# EAGLE design hedwig (EAGLE 9.6.2)

## Sheet 1 of 6
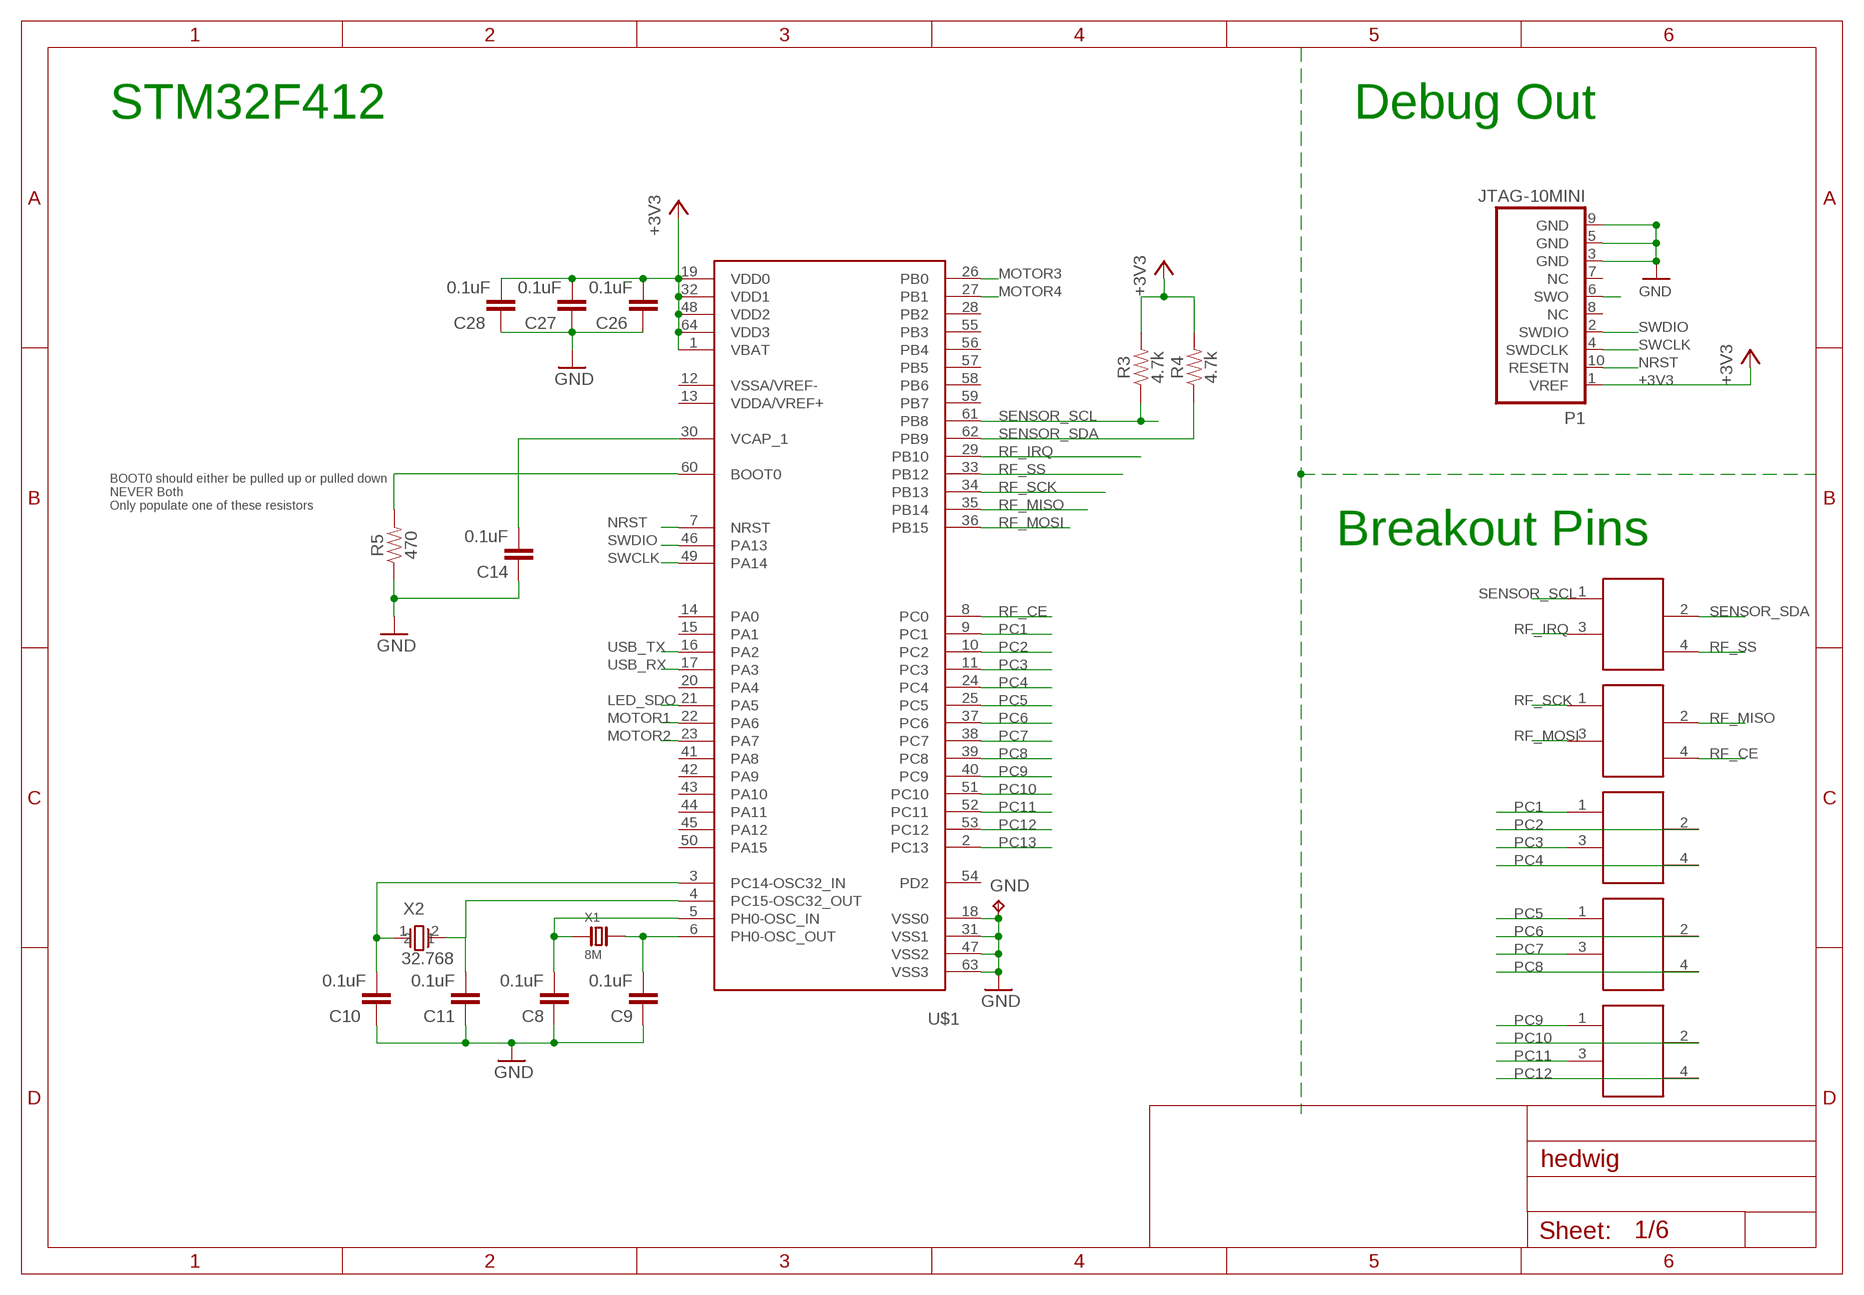
[diagram p0: schematic, sheet 1]

### Parts
C8  0.1uF  0.1UF-0603-25V-(+80/-20%)  [0603]
C9  0.1uF  0.1UF-0603-25V-(+80/-20%)  [0603]
C10  0.1uF  0.1UF-0603-25V-(+80/-20%)  [0603]
C11  0.1uF  0.1UF-0603-25V-(+80/-20%)  [0603]
C14  0.1uF  0.1UF-0603-25V-(+80/-20%)  [0603]
C26  0.1uF  0.1UF-0603-25V-(+80/-20%)  [0603]
C27  0.1uF  0.1UF-0603-25V-(+80/-20%)  [0603]
C28  0.1uF  0.1UF-0603-25V-(+80/-20%)  [0603]
GND  TPB2,54  [B2,54]
P1  JTAG-10MINI  [JTAG-10MINI]
P2  SENSOR_SCL  STAG_CONN  [STAGGERED-CONNECTOR]
P3  RF_SCK  STAG_CONN  [STAGGERED-CONNECTOR]
P4  PC1  STAG_CONN  [STAGGERED-CONNECTOR]
P5  PC5  STAG_CONN  [STAGGERED-CONNECTOR]
P6  PC9  STAG_CONN  [STAGGERED-CONNECTOR]
R3  4.7k  1.5KOHM-0603-1/10W-1%  [0603]
R4  4.7k  1.5KOHM-0603-1/10W-1%  [0603]
R5  470  1.5KOHM-0603-1/10W-1%  [0603]
U$1  STM32F412RE-S  [QFP50P1200X1200X160-64N]
X1  8M  CRYSTAL-NX3225GD  [NDK-NX3225GD]
X2  32.768  NX32  [NDK_NX3215SA-32.768K-STD-MUA-8_0]

### Nets
+3V3: C26.2 C27.2 C28.2 P1.1(VREF) R3.2 R4.2 U$1.1(VBAT) U$1.19(VDD0) U$1.32(VDD1) U$1.48(VDD2) U$1.64(VDD3) ; also sheet 2,3,4,5,6
GND: C8.1 C9.1 C10.1 C11.1 C14.1 C26.1 C27.1 C28.1 GND.TP P1.3(GND) P1.5(GND) P1.9(GND) R5.1 U$1.18(VSS0) U$1.31(VSS1) U$1.47(VSS2) U$1.63(VSS3) ; also sheet 2,3,4,5,6
LED_SDO: U$1.21(PA5) ; also sheet 5
MOTOR1: U$1.22(PA6) ; also sheet 6
MOTOR2: U$1.23(PA7) ; also sheet 6
MOTOR3: U$1.26(PB0) ; also sheet 6
MOTOR4: U$1.27(PB1) ; also sheet 6
N$8: C8.2 U$1.5(PH0-OSC_IN) X1.1
N$10: C9.2 U$1.6(PH0-OSC_OUT) X1.2
N$13: C10.2 U$1.3(PC14-OSC32_IN) X2.1
N$14: C11.2 U$1.4(PC15-OSC32_OUT) X2.2
N$16: R5.2 U$1.60(BOOT0)
N$17: C14.2 U$1.30(VCAP_1)
N$18: P1.6(SWO)
NRST: P1.10(RESETN) U$1.7(NRST) ; also sheet 5
PC1: P4.1 U$1.9(PC1)
PC2: P4.2 U$1.10(PC2)
PC3: P4.3 U$1.11(PC3)
PC4: P4.4 U$1.24(PC4)
PC5: P5.1 U$1.25(PC5)
PC6: P5.2 U$1.37(PC6)
PC7: P5.3 U$1.38(PC7)
PC8: P5.4 U$1.39(PC8)
PC9: P6.1 U$1.40(PC9)
PC10: P6.2 U$1.51(PC10)
PC11: P6.3 U$1.52(PC11)
PC12: P6.4 U$1.53(PC12)
PC13: U$1.2(PC13)
RF_CE: P3.4 U$1.8(PC0) ; also sheet 2
RF_IRQ: P2.3 U$1.29(PB10) ; also sheet 2
RF_MISO: P3.2 U$1.35(PB14) ; also sheet 2
RF_MOSI: P3.3 U$1.36(PB15) ; also sheet 2
RF_SCK: P3.1 U$1.34(PB13) ; also sheet 2
RF_SS: P2.4 U$1.33(PB12) ; also sheet 2
SENSOR_SCL: P2.1 R3.1 U$1.61(PB8) ; also sheet 3
SENSOR_SDA: P2.2 R4.1 U$1.62(PB9) ; also sheet 3
SWCLK: P1.4(SWDCLK) U$1.49(PA14)
SWDIO: P1.2(SWDIO) U$1.46(PA13)
USB_RX: U$1.17(PA3) ; also sheet 4
USB_TX: U$1.16(PA2) ; also sheet 4
Unconnected: P1.7(NC) P1.8(NC) U$1.12(VSSA/VREF-) U$1.13(VDDA/VREF+) U$1.14(PA0) U$1.15(PA1) U$1.20(PA4) U$1.28(PB2) U$1.41(PA8) U$1.42(PA9) U$1.43(PA10) U$1.44(PA11) U$1.45(PA12) U$1.50(PA15) U$1.54(PD2) U$1.55(PB3) U$1.56(PB4) U$1.57(PB5) U$1.58(PB6) U$1.59(PB7)

### Notes on the sheet
- STM32F412 | Debug Out
- BOOT0 should either be pulled up or pulled down
  NEVER Both
  Only populate one of these resistors
- Breakout Pins

## Sheet 2 of 6
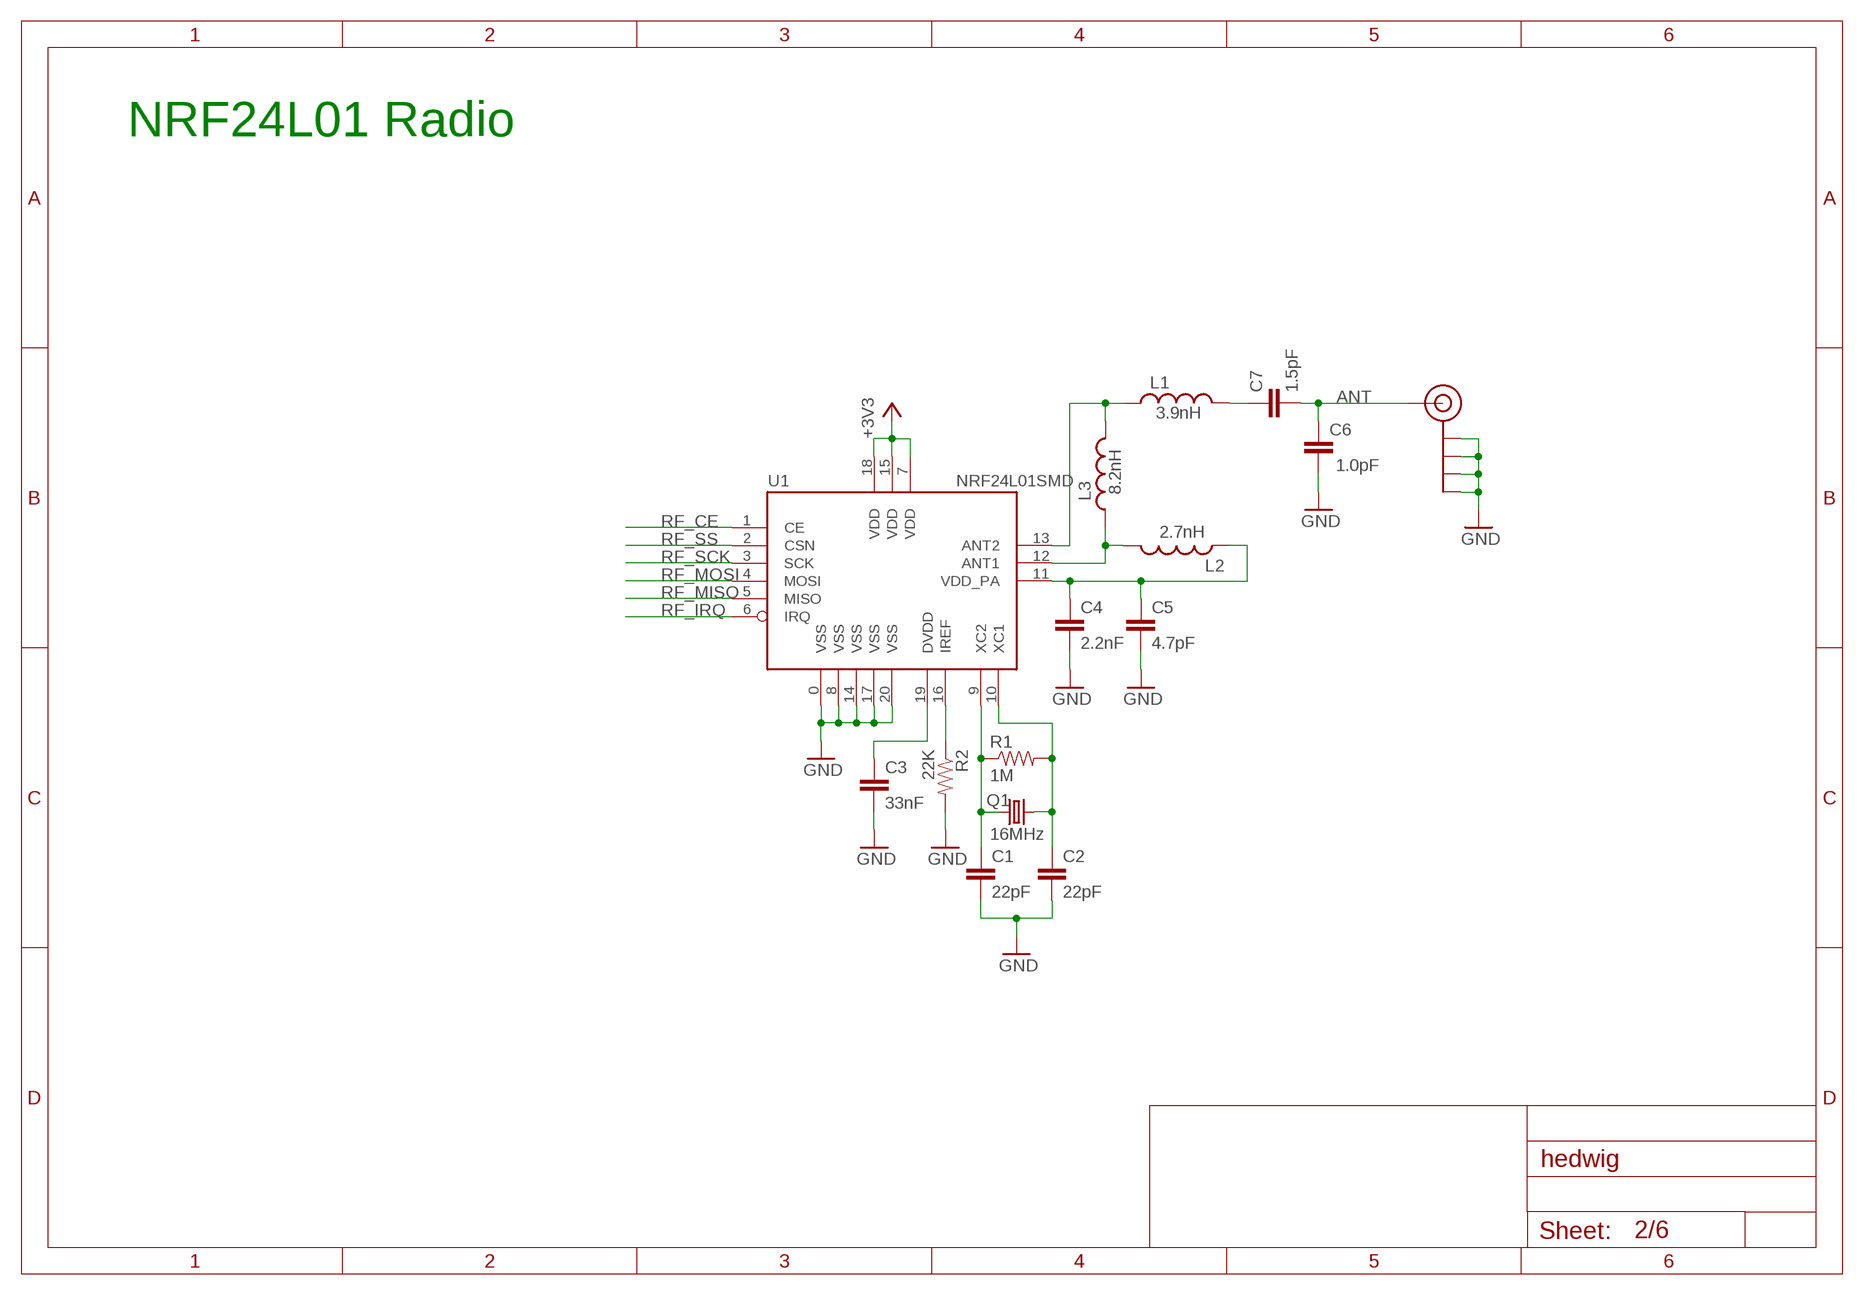
[diagram p1: schematic, sheet 2]

### Parts
C1  22pF  CAP0402  [C0402]
C2  22pF  CAP0402  [C0402]
C3  33nF  CAP0402  [C0402]
C4  2.2nF  CAP0402  [C0402]
C5  4.7pF  CAP0402  [C0402]
C6  1.0pF  CAP0402  [C0402]
C7  1.5pF  CAP0402  [C0402]
J$1  SMA_EDGE  [SMA-EDGE]
L1  3.9nH  INDUCTOR0402  [C0402]
L2  2.7nH  INDUCTOR0402  [C0402]
L3  8.2nH  INDUCTOR0402  [C0402]
Q1  16MHz  CRYSTAL5X3  [CRYSTAL-SMD-5X3]
R1  1M  RESISTOR0402  [C0402]
R2  22K  RESISTOR0402  [C0402]
U1  NRF24L01SMD  [QFN20]

### Nets
+3V3: U1.7(VDD) U1.15(VDD) U1.18(VDD) ; also sheet 1,3,4,5,6
ANT: C6.2 C7.2 J$1.SIG(SIGNAL)
GND: C1.2 C2.2 C3.2 C4.2 C5.2 C6.1 J$1.GND@0(GND) J$1.GND@1(GND) J$1.GND@2(GND) J$1.GND@3(GND) R2.2 U1.0(VSS) U1.8(VSS) U1.14(VSS) U1.17(VSS) U1.20(VSS) ; also sheet 1,3,4,5,6
N$1: C1.1 Q1.1 R1.1 U1.9(XC2)
N$2: C2.1 Q1.3 R1.2 U1.10(XC1)
N$3: L2.2 L3.1 U1.12(ANT1)
N$4: R2.1 U1.16(IREF)
N$5: C3.1 U1.19(DVDD)
N$6: L1.1 L3.2 U1.13(ANT2)
N$7: C4.1 C5.1 L2.1 U1.11(VDD_PA)
N$9: C7.1 L1.2
RF_CE: U1.1(CE) ; also sheet 1
RF_IRQ: U1.6(IRQ) ; also sheet 1
RF_MISO: U1.5(MISO) ; also sheet 1
RF_MOSI: U1.4(MOSI) ; also sheet 1
RF_SCK: U1.3(SCK) ; also sheet 1
RF_SS: U1.2(CSN) ; also sheet 1

### Notes on the sheet
- NRF24L01 Radio

## Sheet 3 of 6
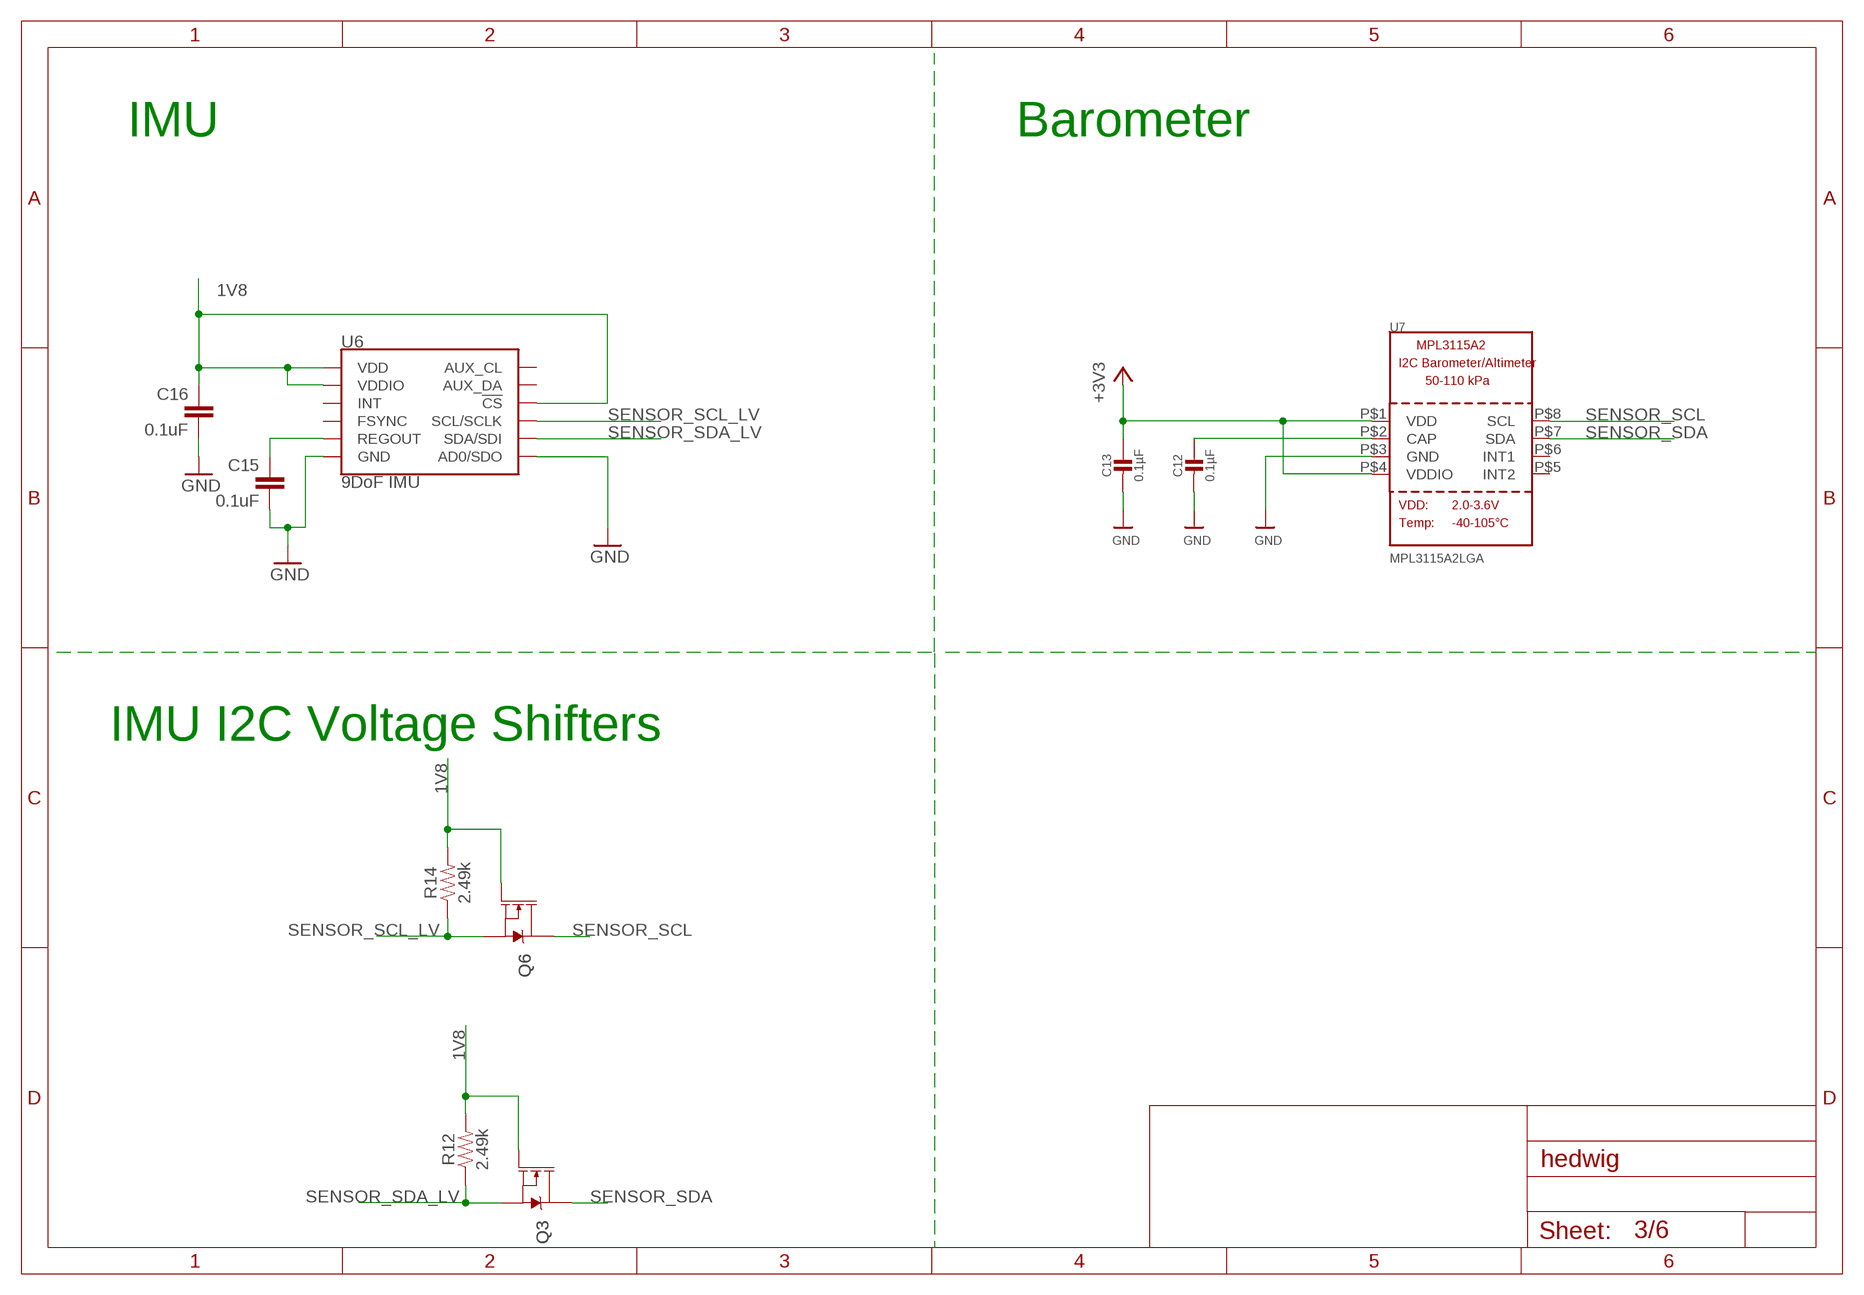
[diagram p2: schematic, sheet 3]

### Parts
C12  0.1µF  CAP_CERAMIC0805-NOOUTLINE  [0805-NO]
C13  0.1µF  CAP_CERAMIC0805-NOOUTLINE  [0805-NO]
C15  0.1uF  0.1UF-25V(+80/-20%)(0603)  [0603-CAP]
C16  0.1uF  0.1UF-25V(+80/-20%)(0603)  [0603-CAP]
Q3  20V/0.2A/8MHz/1.2Ω/1Vth  MOSFET-NCH-RE1C002UN  [SOT-416FL]
Q6  20V/0.2A/8MHz/1.2Ω/1Vth  MOSFET-NCH-RE1C002UN  [SOT-416FL]
R12  2.49k  2.49KOHM-0603-1/10W-1%  [0603]
R14  2.49k  2.49KOHM-0603-1/10W-1%  [0603]
U6  9DoF IMU  ICM-20948  [QFN24-3X3]
U7  MPL3115A2LGA  [LGA8]

### Nets
1V8: C16.1 Q3.1(G) Q6.1(G) R12.2 R14.2 U6.8(VDDIO) U6.13(VDD) U6.22(!CS) ; also sheet 6
+3V3: C13.1 U7.P$1(VDD) U7.P$4(VDDIO) ; also sheet 1,2,4,5,6
ADSD_STUB: U6.9(AD0/SDO) ; supply symbol labelled GND
CAP: C12.1 U7.P$2(CAP)
GND: C12.2 C13.2 C15.2 C16.2 U6.18(GND) U6.20(GND) U7.P$3(GND) ; also sheet 1,2,4,5,6
REGOUT: C15.1 U6.10(REGOUT)
SENSOR_SCL: Q6.3(D) U7.P$8(SCL) ; also sheet 1
SENSOR_SCL_LV: Q6.2(S) R14.1 U6.23(SCL/SCLK)
SENSOR_SDA: Q3.3(D) U7.P$7(SDA) ; also sheet 1
SENSOR_SDA_LV: Q3.2(S) R12.1 U6.24(SDA/SDI)
Unconnected: U6.7(AUX_CL) U6.11(FSYNC) U6.12(INT) U6.21(AUX_DA) U7.P$5(INT2) U7.P$6(INT1)

### Notes on the sheet
- IMU | Barometer
- IMU I2C Voltage Shifters

## Sheet 4 of 6
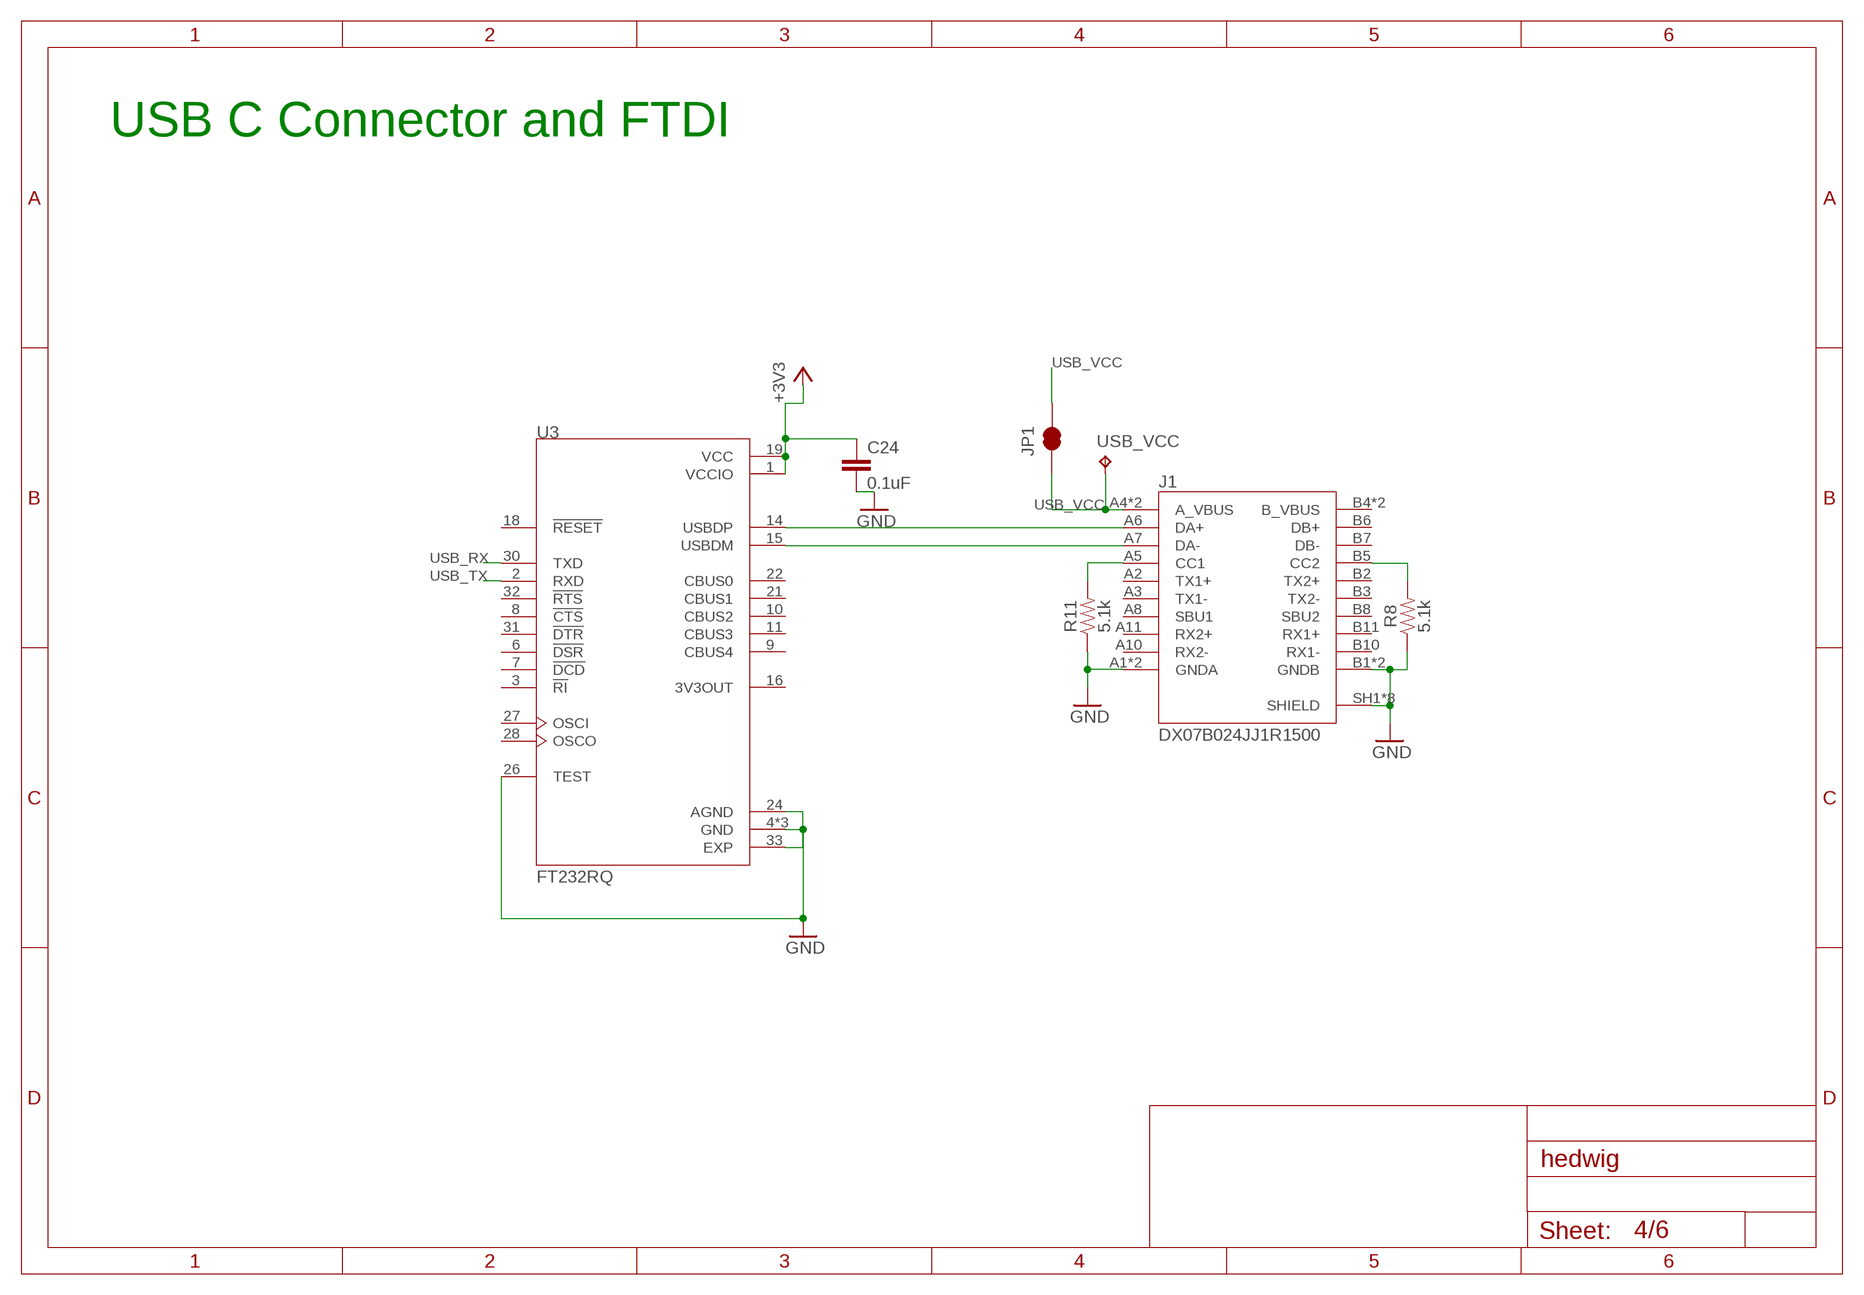
[diagram p3: schematic, sheet 4]

### Parts
C24  0.1uF  0.22UF-0603-25V-10%  [0603@1]
J1  DX07B024JJ1R1500  [JAE_DX07B024JJ1R1500]
JP1  JUMPER-SMT_2_NC_TRACE_SILK  [SMT-JUMPER_2_NC_TRACE_SILK]
R8  5.1k  5.1KOHM5.1KOHM-0603-1/10W-1%  [0603]
R11  5.1k  5.1KOHM5.1KOHM-0603-1/10W-1%  [0603]
U3  FT232RQ  [QFN50P500X500X90-33N]
USB_VCC  TPB2,54  [B2,54]

### Nets
+3V3: C24.1 U3.1(VCCIO) U3.19(VCC) ; also sheet 1,2,3,5,6
GND: C24.2 J1.A1(GNDA) J1.A12(GNDA) J1.B1(GNDB) J1.B12(GNDB) J1.SH1(SHIELD) J1.SH2(SHIELD) J1.SH3(SHIELD) J1.SH4(SHIELD) J1.SH5(SHIELD) J1.SH6(SHIELD) J1.SH7(SHIELD) J1.SH8(SHIELD) R8.1 R11.1 U3.4(GND) U3.17(GND) U3.20(GND) U3.24(AGND) U3.26(TEST) U3.33(EXP) ; also sheet 1,2,3,5,6
N$15: J1.B5(CC2) R8.2
N$21: J1.A6(DA+) U3.14(USBDP)
N$22: J1.A7(DA-) U3.15(USBDM)
N$26: J1.A5(CC1) R11.2
USB_RX: U3.30(TXD) ; also sheet 1
USB_TX: U3.2(RXD) ; also sheet 1
USB_VCC: J1.A4(A_VBUS) J1.A9(A_VBUS) JP1.1 JP1.2 USB_VCC.TP ; also sheet 6
Unconnected: J1.A2(TX1+) J1.A3(TX1-) J1.A8(SBU1) J1.A10(RX2-) J1.A11(RX2+) J1.B2(TX2+) J1.B3(TX2-) J1.B6(DB+) J1.B7(DB-) J1.B8(SBU2) J1.B10(RX1-) J1.B11(RX1+) U3.3(!RI) U3.6(!DSR) U3.7(!DCD) U3.8(!CTS) U3.9(CBUS4) U3.10(CBUS2) U3.11(CBUS3) U3.16(3V3OUT) U3.18(!RESET) U3.21(CBUS1) U3.22(CBUS0) U3.27(OSCI) U3.28(OSCO) U3.31(!DTR) U3.32(!RTS)

### Notes on the sheet
- USB C Connector and FTDI

## Sheet 5 of 6
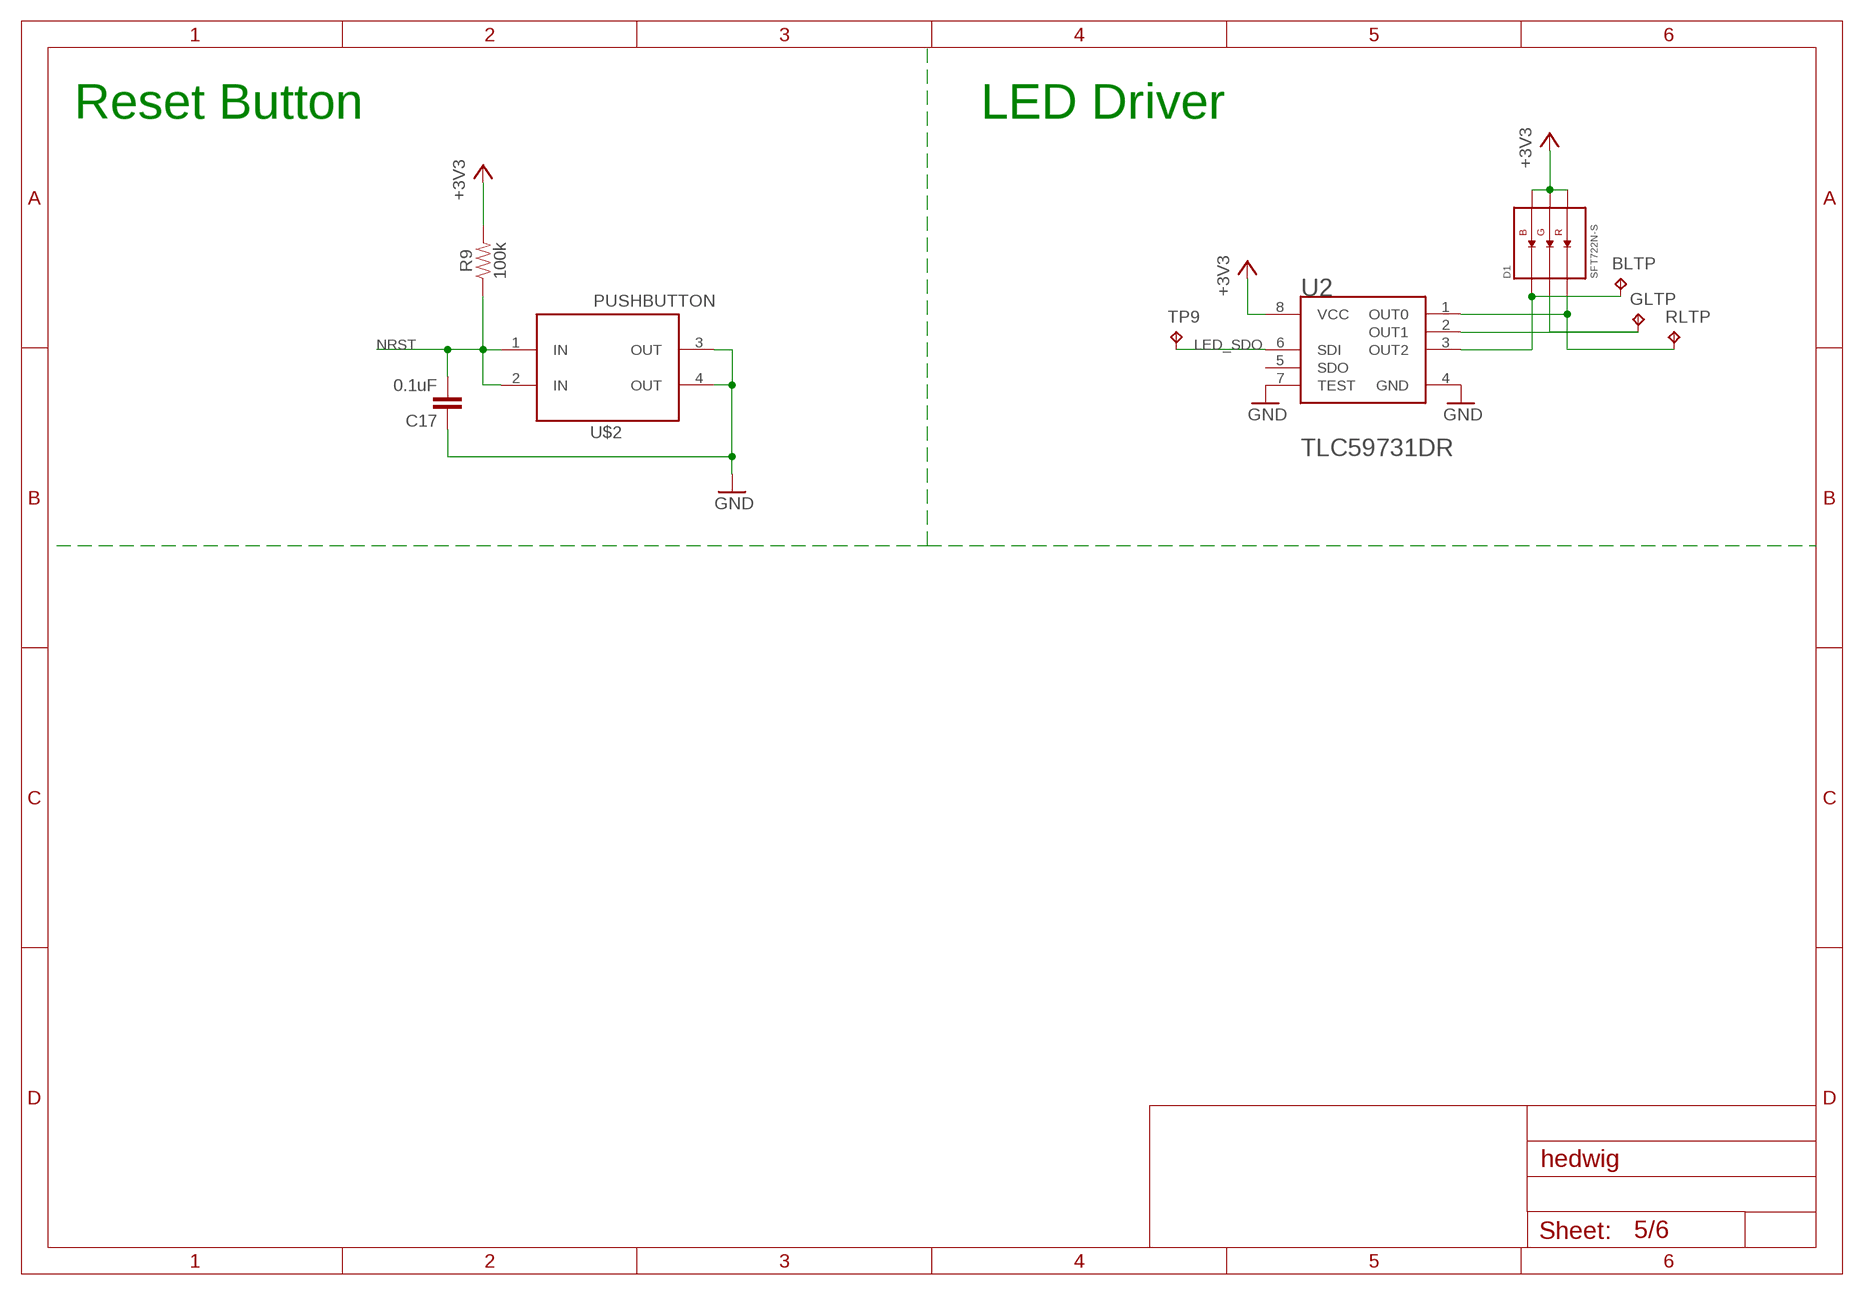
[diagram p4: schematic, sheet 5]

### Parts
BLTP  TPB1,27  [B1,27]
C17  0.1uF  0.1UF-0603-25V-(+80/-20%)  [0603]
D1  SFT722N-S  [LED_SFT722N-S]
GLTP  TPB1,27  [B1,27]
R9  100k  1.5KOHM-0603-1/10W-1%  [0603]
RLTP  TPB1,27  [B1,27]
TP9  TPB1,27  [B1,27]
U2  TEXAS_INSTRUMENTS_TLC59731DRTEXAS_INSTRUMENTS_TLC59731DR_0_0  [TEXAS_INSTRUMENTS_TLC59731DR_0]
U$2  PUSHBUTTON  [PUSH_BUTTON]

### Nets
+3V3: D1.4(RA) D1.5(GA) D1.6(BA) R9.2 U2.8(VCC) ; also sheet 1,2,3,4,6
GND: C17.1 U2.4(GND) U2.7(TEST) U$2.3(OUT) U$2.4(OUT) ; also sheet 1,2,3,4,6
LED_SDO: TP9.TP U2.6(SDI) ; also sheet 1
N$11: BLTP.TP D1.1(BC) U2.3(OUT2)
N$12: D1.3(RC) RLTP.TP U2.1(OUT0)
N$27: D1.2(GC) GLTP.TP U2.2(OUT1)
NRST: C17.2 R9.1 U$2.1(IN) U$2.2(IN) ; also sheet 1
Unconnected: U2.5(SDO)

### Notes on the sheet
- Reset Button | LED Driver

## Sheet 6 of 6
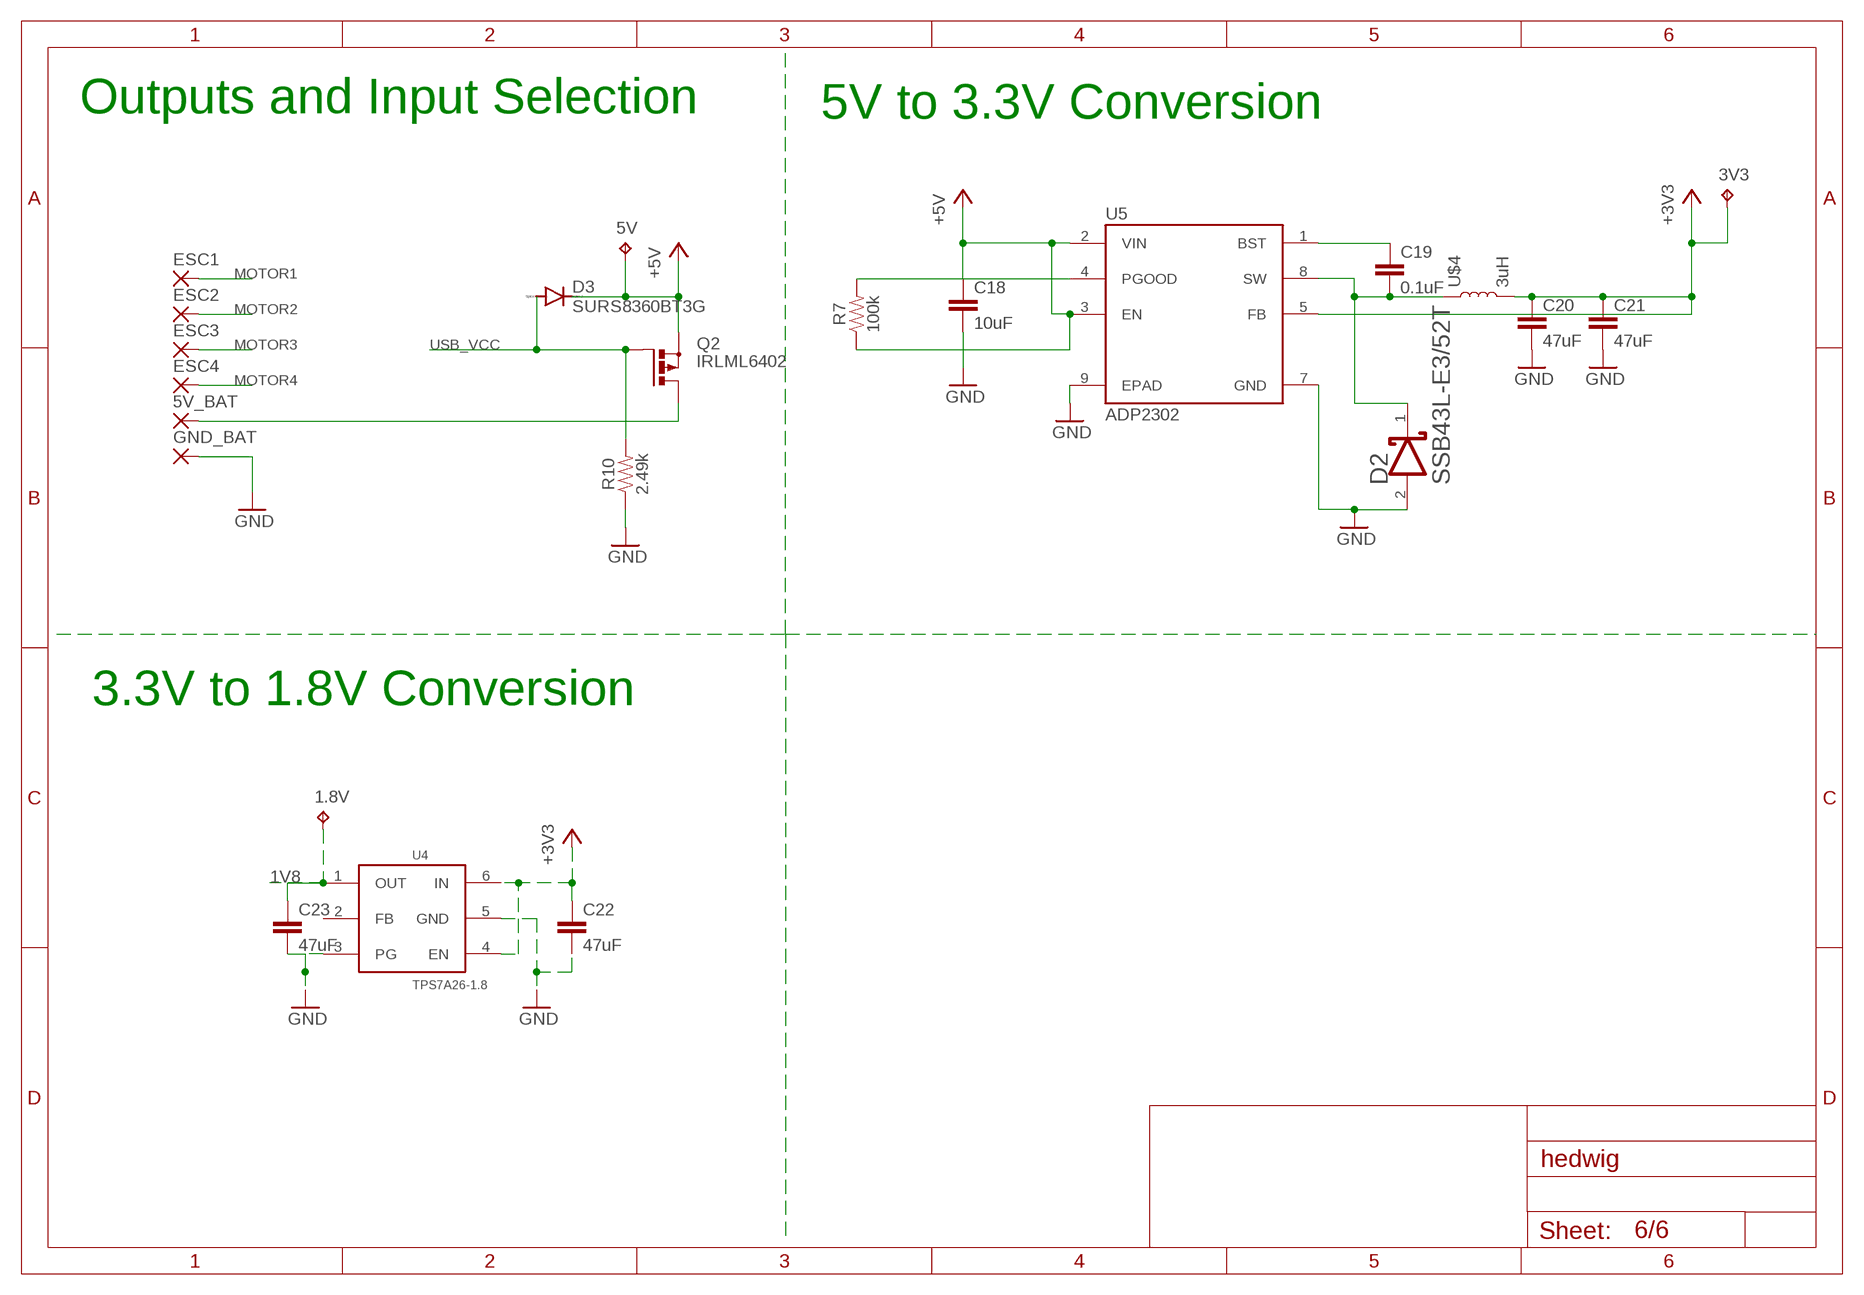
[diagram p5: schematic, sheet 6]

### Parts
1.8V  TPB2,54  [B2,54]
3V3  TPB2,54  [B2,54]
5V  TPB2,54  [B2,54]
5V_BAT  2,54/1,0  [2,54/1,0]
C18  10uF  10UF-0603-6.3V-20%  [0603@1]
C19  0.1uF  0.22UF-0603-25V-10%  [0603@1]
C20  47uF  0.22UF-0603-25V-10%  [0603@1]
C21  47uF  0.22UF-0603-25V-10%  [0603@1]
C22  47uF  4.7UF-0603-35V-(20%)  [0603@1]
C23  47uF  4.7UF-0603-35V-(20%)  [0603@1]
D2  SSB43L  VISHAY_SSB43L-E3-52TVISHAY_SSB43L-E3-52T_0_0  [VISHAY_SSB43L-E3-52T_0]
D3  SURS8360BT3G  DIODE  [SMB]
ESC1  SMD2  [SMD1,27-2,54]
ESC2  SMD2  [SMD1,27-2,54]
ESC3  SMD2  [SMD1,27-2,54]
ESC4  SMD2  [SMD1,27-2,54]
GND_BAT  2,54/1,0  [2,54/1,0]
Q2  IRLML6402  [SOT-23]
R7  100k  100KOHM-0603-1/10W-1%  [0603]
R10  2.49k  2.49KOHM-0603-1/10W-1%  [0603]
U4  TPS7A26-1.8  [WSON]
U5  ADP2302  [SOIC127P600X175-9N]
U$4  3uH  REG_INDUCTOR  [REG_INDUCTOR]

### Nets
1V8: 1.8V.TP C23.1 U4.1(OUT) ; also sheet 3
+3V3: 3V3.TP C20.1 C21.1 C22.1 U4.4(EN) U4.6(IN) U5.5(FB) U$4.@2 ; also sheet 1,2,3,4,5
+5V: 5V.TP C18.1 D3.@2(C) Q2.P2(S) R7.1 U5.2(VIN) U5.3(EN)
GND: C18.2 C20.2 C21.2 C22.2 C23.2 D2.2(ANODE) GND_BAT.1(P) R10.1 U4.3(PG) U4.5(GND) U5.7(GND) U5.9(EPAD) ; also sheet 1,2,3,4,5
MOTOR1: ESC1.1(P) ; also sheet 1
MOTOR2: ESC2.1(P) ; also sheet 1
MOTOR3: ESC3.1(P) ; also sheet 1
MOTOR4: ESC4.1(P) ; also sheet 1
N$20: C19.1 U5.1(BST)
N$23: R7.2 U5.4(PGOOD)
N$24: C19.2 D2.1(CATHODE) U5.8(SW) U$4.@1
N$25: 5V_BAT.1(P) Q2.P3(D)
USB_VCC: D3.@1(A) Q2.P1(G) R10.2 ; also sheet 4
Unconnected: U4.2(FB)

### Notes on the sheet
- Outputs and Input Selection | 5V to 3.3V Conversion
- 3.3V to 1.8V Conversion

## Power pins joined to a net without a drawn wire
B_VBUS: J1.B4(B_VBUS) J1.B9(B_VBUS)

## Library data of the parts
1.8V 3V3 5V BLTP GLTP GND RLTP TP9 USB_VCC = testpad:TP: Test pad
5V_BAT GND_BAT = wirepad:2,54/1,0: THROUGH-HOLE PAD
C1-C7 = SparkFun:CAP: Capacitor Standard 0603 ceramic capacitor, and 0.1" leaded capacitor.
C8-C11 C14 C17 C26-C28 = SparkFun-Capacitors:0.1UF: 0.1µF ceramic capacitors A capacitor is a passive two-terminal electrical component used to store electrical energy temporarily in an electric field.; PROD_ID: CAP-00810
C12 C13 = microbuilder:CAP_CERAMIC: Ceramic Capacitors For new designs, use the packages preceded by an '_' character since they are more reliable: The following footprints should be used on most boards: _0402 - Standard footprint for regular board layouts _0603 - Standard footprint for regular board layouts _0805 - Standard footprint for regular board layouts _1206 - Standard footprint for regular board layouts For extremely tight-pitch boards where space is at a premium, the following 'micro-pitch' footprints can be used (smaller pads, no silkscreen outline, etc.): _0402MP - Micro-pitch footprint for very dense/compact boards _0603MP - Micro-pitch footprint for very dense/compact boards _0805MP - Micro-pitch footprint for very dense/compact boards _1206MP - Micro-pitch footprint for very dense/compact boards
C15 C16 = SparkFun-Capacitors:0.1UF-25V(+80/-20%)(0603): CAP-00810 Ceramic Standard decoupling cap; PROD_ID: CAP-00810
C18 = SparkFun-Capacitors:10UF: 10.0µF ceramic capacitors A capacitor is a passive two-terminal electrical component used to store electrical energy temporarily in an electric field.; PROD_ID: CAP-11015
C19-C21 C24 = SparkFun-Capacitors:0.22UF: 0.22µF ceramic capacitors A capacitor is a passive two-terminal electrical component used to store electrical energy temporarily in an electric field.; PROD_ID: CAP-07822; VALUE: 0.22uF
C22 C23 = SparkFun-Capacitors:4.7UF: 4.7µF ceramic capacitors A capacitor is a passive two-terminal electrical component used to store electrical energy temporarily in an electric field.; PROD_ID: CAP-14106; VALUE: 4.7uF
D1 = SFT722N-S:SFT722N-S: Top View LED Full Colour 6050 SFT722N-S; DESCRIPTION: Red, Green, Blue (RGB) 623nm Red, 527nm Green, 460nm Blue LED Indication - Discrete 2.1V Red, 3.2V Green, 3.2V Blue 6-SMD, J-Lead; DIGI-KEY_PART_NUMBER: 897-1040-1-ND; MF: Seoul Semiconductor; MP: SFT722N-S; PACKAGE: PLCC-6 Seoul Semiconductor
D2 = 52T:VISHAY_SSB43L-E3-52T: Diode Schottky 30V 4A 2-Pin SMB T/R; CENTROID_NOT_SPECIFIED: No; DATASHEET: http://www.vishay.com/docs/88884/ssb43l.pdf; DC_BLOCKING_VOLTAGE: 30V; DEVICE_CLASS_L1: Discrete Semiconductors; DEVICE_CLASS_L2: Diodes; DEVICE_CLASS_L3: Schottky Diodes; DIGIKEY_DESCRIPTION: DIODE SCHOTTKY 30V 4A DO214AA; DIGIKEY_PART_NUMBER: SSB43L-E3/52TGICT-ND; FORWARD_CURRENT: 4A; HEIGHT: 2.44mm; LEAD_FREE: yes; MAX_JUNCTION_TEMP: +150°C; MAX_REPETITIVE_REVERSE_VOLTAGE: 30V; MAX_SURGE_FORWARD_CURRENT: 100A; MF: Vishay; MFG_PACKAGE_IDENT: SSB43L-E3/52T; MFG_PACKAGE_IDENT_DATE: 0; MFG_PACKAGE_IDENT_REV: 0; MOUSER_DESCRIPTION: Schottky Diodes & Rectifiers 4.0 Amp 30 Volt; MOUSER_PART_NUMBER: 625-SSB43L-E3; MPN: SSB43L-E3/52T; PACKAGE: SMB; PEAK_REVERSE_CURRENT: 0.6mA; PREFIX: D; REVERSE_VOLTAGE: 21V; ROHS: yes; STANDOFF_HEIGHT: 0mm; TEMPERATURE_RANGE_HIGH: +150°C; TEMPERATURE_RANGE_LOW: -65°C; VERIFICATION_VERSION: 0.0.0.1
D3 = falcon:DIODE
ESC1-ESC4 = wirepad:SMD2: SMD PAD
J1 = DX07B024JJ1R1500:DX07B024JJ1R1500: mid mount dual row SMT receptacle, 24 position, 1500 pcs/reel; AVAILABILITY: Unavailable; DESCRIPTION: USB-C (USB TYPE-C) USB 3.2 Gen 2 (USB 3.1 Gen 2, Superspeed + (USB 3.1)) Receptacle Connector 24 Position Board Edge, Cutout; Surface Mount; Through Hole, Right Angle; MF: JAE Electronics; MP: DX07B024JJ1R1500; PACKAGE: None; PRICE: None
J$1 = SparkFun:SMA_EDGE: SMA Antenna Connector End launch SMA connector. The paste layer has been removed so that the connector can be hand soldered onto the board after reflow.
JP1 = SparkFun-Jumpers:JUMPER-SMT_2_NC_TRACE: Normally closed trace jumper This jumper has a trace between two pads so it's normally closed (NC). Use a razor knife to open the connection. For best results follow the IPC guidelines for cutting traces: Cutout at least 0.063 mm (0.005 in). Remove all loose material to clean up the cut area. Seal the cut with an approved epoxy. Reapply solder to reclose the connection.
L1-L3 = SparkFun:INDUCTOR: Inductors Basic Inductor/Choke - 0603 and 1206. Footprints are not proven and vary greatly between part numbers.
P1 = falcon:JTAG-10MINI
P2-P6 = falcon:STAG_CONN
Q1 = SparkFun:CRYSTAL: Crystals Various standard crystals. Proven footprints. Spark Fun Electronics SKU : COM-00534
Q2 = mosfet:IRLML6402: Pch MOSFET IRLML6402 20V 3.7A http://akizukidenshi.com/catalog/g/gI-02553/ I-02553
Q3 Q6 = SparkFun-DiscreteSemi:MOSFET-NCH: N-channel MOSFETs Voltage controlled devices that allow control of high current outputs. SparkFun Products: SparkFun OpenScale <https://www.sparkfun.com/products/13261> SparkFun Digital Sandbox <https://www.sparkfun.com/products/12651> SparkFun Monster Moto Shield <https://www.sparkfun.com/products/10182> SparkFun MOSFET Power Controller <https://www.sparkfun.com/products/11214>; PROD_ID: TRANS_14399
R1 R2 = SparkFun:RESISTOR: Resistor Basic schematic elements and footprints for 0603, 1206, and PTH 1/10th watt (small) resistors.
R3-R5 R9 = SparkFun-Resistors:1.5KOHM: 1.5kΩ resistor A resistor is a passive two-terminal electrical component that implements electrical resistance as a circuit element. Resistors act to reduce current flow, and, at the same time, act to lower voltage levels within circuits. - Wikipedia; PROD_ID: RES-08306; VALUE: 1.5k
R7 = SparkFun-Resistors:100KOHM: 100kΩ resistor A resistor is a passive two-terminal electrical component that implements electrical resistance as a circuit element. Resistors act to reduce current flow, and, at the same time, act to lower voltage levels within circuits. - Wikipedia; PROD_ID: RES-07828
R8 R11 = SparkFun-Resistors:5.1KOHM; PROD_ID: RES-12083
R10 R12 R14 = SparkFun-Resistors:2.49KOHM: 2.49kΩ resistor A resistor is a passive two-terminal electrical component that implements electrical resistance as a circuit element. Resistors act to reduce current flow, and, at the same time, act to lower voltage levels within circuits. - Wikipedia; PROD_ID: RES-09568
U1 = SparkFun:NRF24L01: 2.4GHz Low Power Transceiver This is the very popular, low cost, very low power RF transceiver from Nordic Semiconductor. Simple SPI interface. SKU: COM-00690
U2 = Texas Instruments - TLC59731DR:TEXAS_INSTRUMENTS_TLC59731DR: 3-Channel, 8-Bit, PWM LED Driver With Single-Wire Interface; CENTROID_NOT_SPECIFIED: No; CURRENT_-_OUTPUT_/_CHANNEL: 50mA; DATASHEET: http://www.ti.com/lit/ds/symlink/tlc59731.pdf; DIGIKEY_DESCRIPTION: IC LED DRVR PWM 8B 3CH 8SOIC; DIGIKEY_PART_NUMBER: 296-40590-1-ND; FREQUENCY: 6MHz; LEAD_FREE: yes; MF: Texas Instruments; MFG_PACKAGE_IDENT: D (R-PDSO-G8); MOUSER_PART_NUMBER: 595-TLC59731DR; MPN: TLC59731DR; PACKAGE: SOIC8; PREFIX: U; ROHS: yes; TEMPERATURE_RANGE_HIGH: +125°C; TEMPERATURE_RANGE_LOW: -40°C
U3 = FT232RQ:FT232RQ: USB-to-UART 1-CH 256Byte FIFO 5V 32-Pin QFN EP; AVAILABILITY: Unavailable; DESCRIPTION: USB Bridge, USB to UART USB 2.0 UART Interface 32-QFN (5x5); MF: FTDI, Future; MP: FT232RQ; PACKAGE: VFQFN-32 FTDI, Future; PRICE: None
U4 = falcon:TPS7A26-1.8
U5 = falcon:ADP2302
U6 = SparkFun-Sensors:ICM-20948: ICM-20948 9 Degree of Freedom IMU World’s lowest power 9-axis MotionTracking device that is ideally suited for smartphones, tablets, wearable sensors, and IoT applications. Includes onboard Digital Motion Processor to offload computations from the host processor Datasheet <https://cdn.sparkfun.com/assets/learn_tutorials/5/5/0/MPU9250REV1.0.pdf> SparkFun Products: SparkFun IMU Breakout - ICM-20948 <https://www.sparkfun.com/products/15182>; PROD_ID: IC-14247
U7 = microbuilder:MPL3115A2
U$1 = mystm2:STM32F412RE-S
U$2 = falcon:PUSHBUTTON
U$4 = falcon:REG_INDUCTOR
X1 = FaBo-Crystal:CRYSTAL
X2 = NDK - NX3215SA-32.768K-STD-MUA-8:NX32

## Board
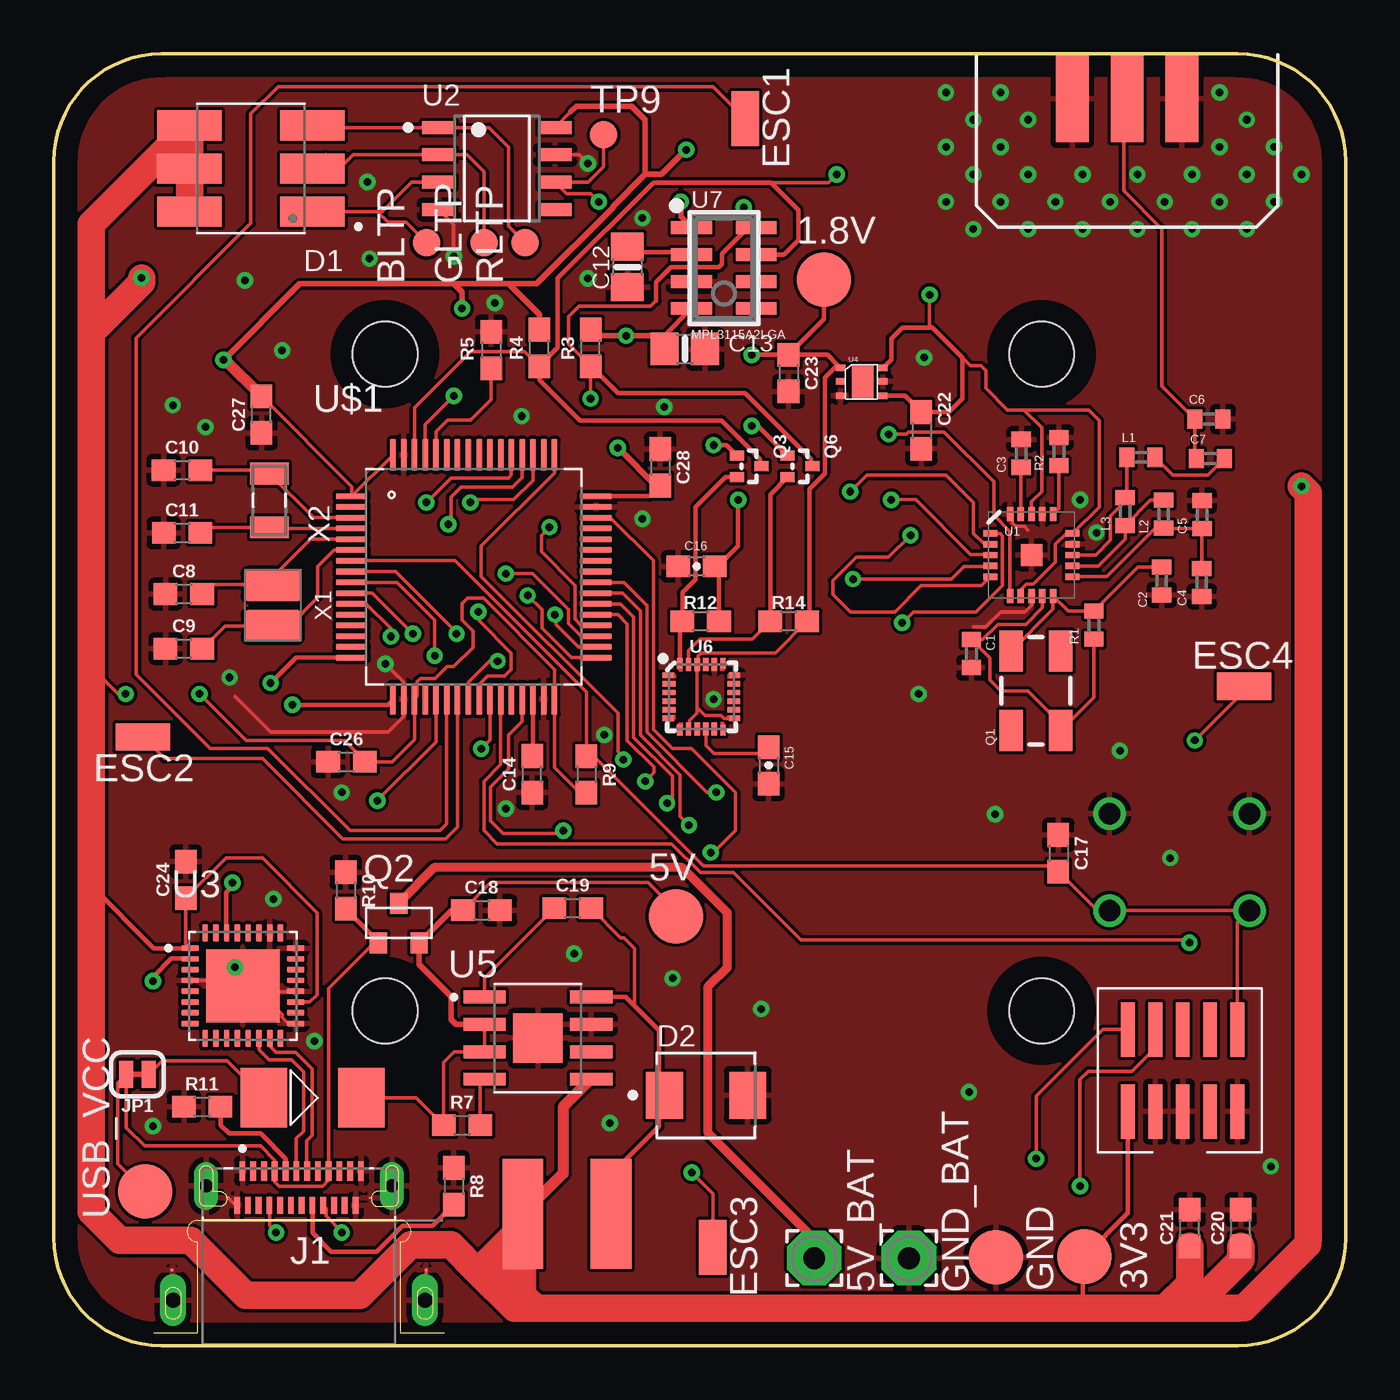
[diagram p6: board, top side]
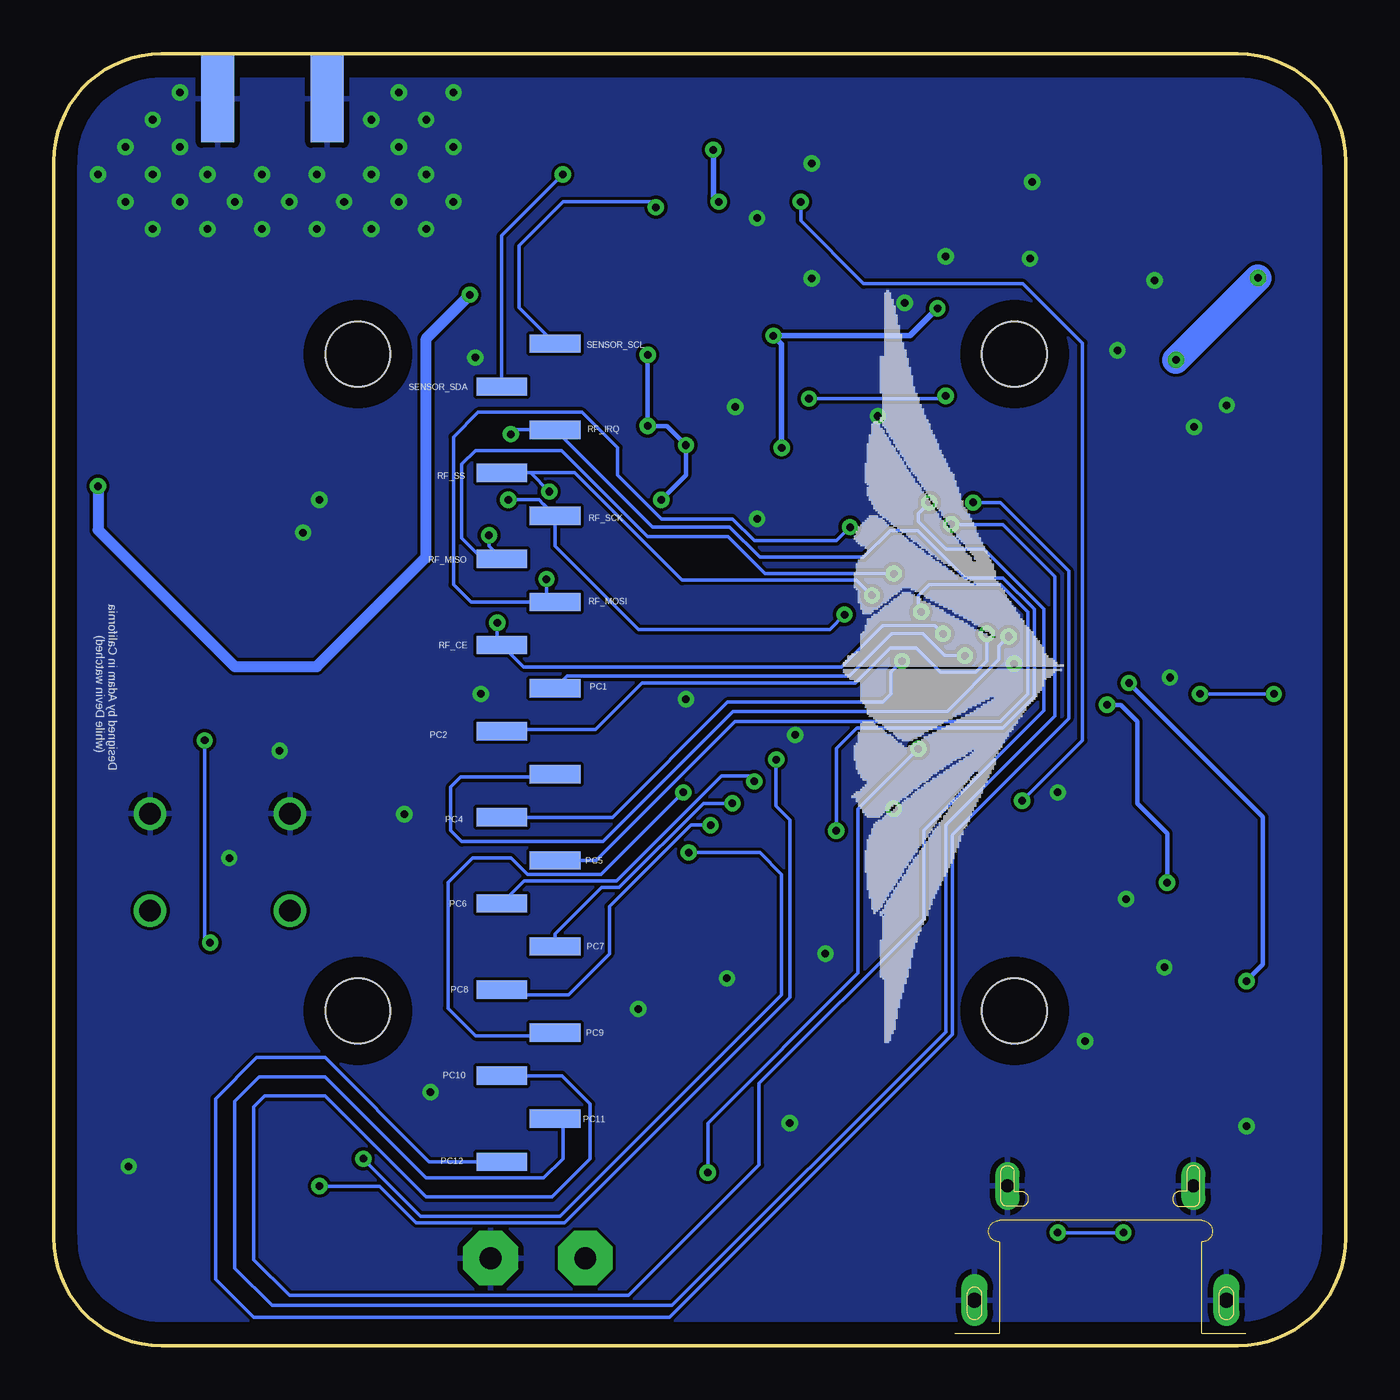
[diagram p7: board, bottom side, seen from below]

Size 60 x 60 mm. Coordinates in mm from the lower left corner, seen from the top.
Outline: 0,55 0,5 arc90 5,0 55,0 arc90 60,5 60,55 arc90 55,60 5,60 arc90 0,55
Copper layers (1*16): Top 0.035mm / dielectric 1.5mm / Bottom 0.035mm
Design rules "default": minimum track width 6mil, minimum drill 0.35mm, track to track 6mil, track to pad 6mil, pad to pad 6mil, via to via 6mil, smd to smd 6mil, copper to edge 40mil, drill to drill 6mil, minimum pad ring 10mil, minimum via ring 8mil, stop-mask expansion 4mil, vias tented up to drill 0mil, thermal gap 10mil
Holes 3 mm at 15.38,46.05 45.88,46.05 15.38,15.55 45.88,15.55

### Footprints (pad centres in the part's own frame; a part is rotated, then mirrored left to right if it is on the bottom)
B2,54 = smd 2.54 x 2.54: TP 0,0
2,54/1,0 = drill 1.016 pad 2.54 octagon: 1 0,0
B1,27 = smd 1.27 x 1.27: TP 0,0
C0402 = smd 0.7 x 0.9: 1 -0.65,0; 2 0.65,0
0603 = smd 1.1 x 1: 1 -0.85,0; 2 0.85,0
0805-NO = smd 1.3 x 1.5: 1 -0.95,0; 2 0.95,0
0603-CAP = smd 1.1 x 1: 1 -0.85,0; 2 0.85,0
0603@1 = smd 1.1 x 1: 1 -0.85,0; 2 0.85,0
LED_SFT722N-S = smd 3 x 1.4: 1 -2.85,2; 2 -2.85,0; 3 -2.85,-2; 4 2.85,-2; 5 2.85,0; 6 2.85,2
VISHAY_SSB43L-E3-52T_0 = smd 1.716 x 2.18: 1 -1.937,0; 2 1.937,0
SMB = smd 2.159 x 2.743: @1 -2.5,0; @2 2.022,0
SMD1,27-2,54 = smd 1.27 x 2.54: 1 0,0
JAE_DX07B024JJ1R1500 = smd 0.27 x 0.9: A1 -2.625,0.7; A2 -2.125,0.7; A3 -1.625,0.7; A4 -1.125,0.7; A5 -0.625,0.7; A6 -0.125,0.7; A7 0.375,0.7; A8 0.875,0.7; A9 1.375,0.7; A10 1.875,0.7; A11 2.375,0.7; A12 2.875,0.7 | smd 0.27 x 0.8: B1 2.625,-0.9; B2 2.125,-0.9; B3 1.625,-0.9; B4 1.125,-0.9; B5 0.625,-0.9; B6 0.125,-0.9; B7 -0.375,-0.9; B8 -0.875,-0.9; B9 -1.375,-0.9; B10 -1.875,-0.9; B11 -2.375,-0.9; B12 -2.875,-0.9 | smd 0.1 x 0.1: SH1 -5.9,-3.9; SH2 5.9,-3.9; SH3 -3.3,-0.55; SH4 3.3,-0.55 | drill 0.6 long: SH5 -4.32,0; SH6 4.32,0 | drill 0.7 long: SH7 -5.85,-5.3; SH8 5.85,-5.3
SMA-EDGE = smd 1.524 x 4.064: GND@0 0,0; GND@1 5.08,0; SIG 2.54,0 | smd 1.524 x 4.064 bottom: GND@2 0,0; GND@3 5.08,0
SMT-JUMPER_2_NC_TRACE_SILK = smd 0.66 x 1.27: 1 -0.521,0; 2 0.521,0
JTAG-10MINI = smd 0.64 x 2.54: 1 -2.413,-1.905; 2 -2.413,1.905; 3 -1.143,-1.905; 4 -1.143,1.905; 5 0.127,-1.905; 6 0.127,1.905; 7 1.397,-1.905; 8 1.397,1.905; 9 2.667,-1.905; 10 2.667,1.905
STAGGERED-CONNECTOR = smd 0.85 x 2.35: 1 -3,1; 2 -1,-1.476; 3 1,1; 4 3,-1.476
CRYSTAL-SMD-5X3 = smd 1.9 x 1.1: 1 -1.85,-1.15; 2 1.85,-1.15; 3 1.85,1.15; 4 -1.85,1.15
SOT-23 = smd 0.802 x 0.972: P1 -0.95,-0.917; P2 0.95,-0.917; P3 0,0.917
SOT-416FL = smd 0.46 x 0.65: 1 -0.5,-1.1; 2 0.5,-1.1; 3 0,0.05
QFN20 = smd 1 x 1: 0 0,0 | smd 0.65 x 0.3: 1 -1.9,1; 2 -1.9,0.5; 3 -1.9,0; 4 -1.9,-0.5; 5 -1.9,-1; 11 1.9,-1; 12 1.9,-0.5; 13 1.9,0; 14 1.9,0.5; 15 1.9,1 | smd 0.3 x 0.65: 6 -1,-1.9; 7 -0.5,-1.9; 8 0,-1.9; 9 0.5,-1.9; 10 1,-1.9; 16 1,1.9; 17 0.5,1.9; 18 0,1.9; 19 -0.5,1.9; 20 -1,1.9
TEXAS_INSTRUMENTS_TLC59731DR_0 = smd 1.55 x 0.6: 1 -2.7,1.905; 2 -2.7,0.635; 3 -2.7,-0.635; 4 -2.7,-1.905; 5 2.7,-1.905; 6 2.7,-0.635; 7 2.7,0.635; 8 2.7,1.905 | smd 1.5 x 0.55: SMD_9 -2.7,1.905; SMD_10 -2.7,0.635; SMD_11 -2.7,-0.635; SMD_12 -2.7,-1.905; SMD_13 2.7,1.905; SMD_14 2.7,0.635; SMD_15 2.7,-0.635; SMD_16 2.7,-1.905
QFN50P500X500X90-33N = smd 0.81 x 0.27: 1 -2.45,1.75; 2 -2.45,1.25; 3 -2.45,0.75; 4 -2.45,0.25; 5 -2.45,-0.25; 6 -2.45,-0.75; 7 -2.45,-1.25; 8 -2.45,-1.75; 17 2.45,-1.75; 18 2.45,-1.25; 19 2.45,-0.75; 20 2.45,-0.25; 21 2.45,0.25; 22 2.45,0.75; 23 2.45,1.25; 24 2.45,1.75 | smd 0.27 x 0.81: 9 -1.75,-2.45; 10 -1.25,-2.45; 11 -0.75,-2.45; 12 -0.25,-2.45; 13 0.25,-2.45; 14 0.75,-2.45; 15 1.25,-2.45; 16 1.75,-2.45; 25 1.75,2.45; 26 1.25,2.45; 27 0.75,2.45; 28 0.25,2.45; 29 -0.25,2.45; 30 -0.75,2.45; 31 -1.25,2.45; 32 -1.75,2.45 | smd 3.4 x 3.4: 33 0,0
WSON = smd 0.45 x 0.3: 1 -1.02,0.59; 2 -1.02,-0.03; 3 -1.02,-0.7; 4 0.94,-0.7; 5 0.94,-0.03; 6 0.94,0.59 | smd 1 x 1.6: 7 0,-0.05
SOIC127P600X175-9N = smd 1.97 x 0.6: 1 -2.475,1.905; 2 -2.475,0.635; 3 -2.475,-0.635; 4 -2.475,-1.905; 5 2.475,-1.905; 6 2.475,-0.635; 7 2.475,0.635; 8 2.475,1.905 | smd 2.29 x 2.29: 9 0,0
QFN24-3X3 = smd 0.495 x 0.25: 1 -1.552,1; 6 -1.552,-1; 13 1.552,-1; 18 1.552,1 | smd 0.6 x 0.25: 2 -1.5,0.6; 3 -1.5,0.2; 4 -1.5,-0.2; 5 -1.5,-0.6; 14 1.5,-0.6; 15 1.5,-0.2; 16 1.5,0.2; 17 1.5,0.6 | smd 0.25 x 0.495: 7 -1,-1.552; 12 1,-1.552; 19 1,1.552; 24 -1,1.552 | smd 0.25 x 0.6: 8 -0.6,-1.5; 9 -0.2,-1.5; 10 0.2,-1.5; 11 0.6,-1.5; 20 0.6,1.5; 21 0.2,1.5; 22 -0.2,1.5; 23 -0.6,1.5
LGA8 = smd 1.9 x 0.6: P$1 -1.5,1.875; P$2 -1.5,0.625; P$3 -1.5,-0.625; P$4 -1.5,-1.875; P$5 1.5,-1.875; P$6 1.5,-0.625; P$7 1.5,0.625; P$8 1.5,1.875
QFP50P1200X1200X160-64N = smd 1.47 x 0.28: 1 -5.67,3.75; 2 -5.67,3.25; 3 -5.67,2.75; 4 -5.67,2.25; 5 -5.67,1.75; 6 -5.67,1.25; 7 -5.67,0.75; 8 -5.67,0.25; 9 -5.67,-0.25; 10 -5.67,-0.75; 11 -5.67,-1.25; 12 -5.67,-1.75; 13 -5.67,-2.25; 14 -5.67,-2.75; 15 -5.67,-3.25; 16 -5.67,-3.75; 33 5.67,-3.75; 34 5.67,-3.25; 35 5.67,-2.75; 36 5.67,-2.25; 37 5.67,-1.75; 38 5.67,-1.25; 39 5.67,-0.75; 40 5.67,-0.25; 41 5.67,0.25; 42 5.67,0.75; 43 5.67,1.25; 44 5.67,1.75; 45 5.67,2.25; 46 5.67,2.75; 47 5.67,3.25; 48 5.67,3.75 | smd 0.28 x 1.47: 17 -3.75,-5.67; 18 -3.25,-5.67; 19 -2.75,-5.67; 20 -2.25,-5.67; 21 -1.75,-5.67; 22 -1.25,-5.67; 23 -0.75,-5.67; 24 -0.25,-5.67; 25 0.25,-5.67; 26 0.75,-5.67; 27 1.25,-5.67; 28 1.75,-5.67; 29 2.25,-5.67; 30 2.75,-5.67; 31 3.25,-5.67; 32 3.75,-5.67; 49 3.75,5.67; 50 3.25,5.67; 51 2.75,5.67; 52 2.25,5.67; 53 1.75,5.67; 54 1.25,5.67; 55 0.75,5.67; 56 0.25,5.67; 57 -0.25,5.67; 58 -0.75,5.67; 59 -1.25,5.67; 60 -1.75,5.67; 61 -2.25,5.67; 62 -2.75,5.67; 63 -3.25,5.67; 64 -3.75,5.67
PUSH_BUTTON = drill 1: 1 -4,-2; 2 2.5,-2; 3 -4,2.5; 4 2.5,2.5
REG_INDUCTOR = smd 1.9 x 5.1: @1 -3,0; @2 1.1,0
NDK-NX3225GD = smd 1.5 x 2.7: 1 -0.95,0; 2 0.95,0
NDK_NX3215SA-32.768K-STD-MUA-8_0 = smd 1 x 1.8: 1 -1.25,0; 2 1.25,0

### Placement (x,y rotation side)
1.8V  35.77,49.52 0 top
3V3  47.86,4.14 270 top
5V  28.89,19.95 0 top
5V_BAT  35.31,4.06 270 top
BLTP  17.31,51.23 90 top
C1  42.62,32.14 270 top
C2  51.46,35.52 270 top
C3  44.93,41.44 90 top
C4  53.31,35.45 270 top
C5  53.33,38.6 90 top
C6  53.65,43.04 180 top
C7  53.71,41.2 180 top
C8  6.04,34.91 0 top
C9  6.04,32.37 0 top
C10  5.95,40.66 0 top
C11  5.96,37.75 0 top
C12  26.64,50.1 270 top
C13  29.3,46.29 0 top
C14  22.21,26.54 90 top
C15  33.2,26.95 270 top
C16  29.85,36.19 180 top
C17  46.65,22.87 270 top
C18  19.86,20.23 0 top
C19  24.1,20.32 0 top
C20  55.12,5.47 90 top
C21  52.75,5.47 90 top
C22  40.29,42.51 270 top
C23  34.12,45.17 270 top
C24  6.13,21.63 90 top
C26  13.59,27.11 0 top
C27  9.65,43.24 90 top
C28  28.16,40.8 270 top
D1  9.15,54.67 180 top
D2  30.29,11.63 0 top
D3  12.26,11.52 0 top
ESC1  32.11,56.98 180 top
ESC2  4.14,28.27 90 top
ESC3  30.61,4.57 180 top
ESC4  55.28,30.63 270 top
GLTP  19.97,51.23 90 top
GND  43.76,4.1 270 top
GND_BAT  39.71,4.06 270 top
J1  11.39,7.41 0 top
J$1  52.39,57.93 180 top
JP1  3.89,12.6 180 top
L1  50.49,41.26 0 top
L2  51.54,38.62 90 top
L3  49.76,38.74 90 top
P1  52.3,12.78 0 top
P2  37.72,43.54 270 bottom
P3  37.72,35.54 270 bottom
P4  37.72,27.54 270 bottom
P5  37.72,19.54 270 bottom
P6  37.72,11.54 270 bottom
Q1  45.61,30.42 90 top
Q2  16.02,19.63 0 top
Q3  32.82,40.85 270 top
Q6  35.19,40.85 270 top
R1  48.31,33.47 90 top
R2  46.68,41.53 90 top
R3  24.94,46.34 90 top
R4  22.55,46.34 90 top
R5  20.31,46.24 270 top
R7  18.96,10.24 0 top
R8  18.58,7.41 270 top
R9  24.73,26.53 270 top
R10  13.56,21.14 270 top
R11  6.89,11.09 0 top
R12  30.04,33.65 0 top
R14  34.13,33.65 0 top
RLTP  21.88,51.23 90 top
TP9  25.54,56.24 0 top
U1  45.41,36.72 0 top
U2  20.58,54.67 0 top
U3  8.78,16.71 0 top
U4  37.56,44.82 0 top
U5  22.48,14.29 0 top
U6  30.08,30.14 0 top
U7  31.12,50.05 0 top
U$1  19.5,35.7 0 top
U$2  53.03,22.21 0 top
U$4  22.88,6.12 180 top
USB_VCC  4.25,7.17 90 top
X1  10.17,34.38 270 top
X2  10.01,39.25 270 top

### Tracks (layer width: path | path; a pad name or v marks a point on that pad's centre or on a via)
1V8  (via drill 0.35)
  Top 0.152: R14.2 33.51,32.18 30.07,32.18 29.93,32.03 29.93,31.68 U6.22 29.88,29.64 | U6.8 29.53,28.68 29.53,29.03 29.88,29.39 29.88,29.64 | U6.13 31.12,29.14 31,29.27 30.25,29.27 29.88,29.64
  Top 0.2: C23.1 35.93,46.02 36.4,45.55 | 36.4,45.55 U4.1 | C23.1 35.77,47.67 1.8V.TP | 34.58,46.02 C23.1 | C23.1 v32.42,46.02 | Q6.1 32.71,42.72 v32.42,42.72 | v30.64,41.83 31.24,41.83 Q3.1 | C16.1 30.78,36.12 | 30.78,36.12 30.89,36.01 R12.2 | v31.79,39.29 31.79,37.13 30.78,36.12 | R14.2 35.09,33.76 35.09,39.79 35.81,40.51 35.81,44.97 36.4,45.55
  Bottom 0.2: v32.42,46.02 v32.42,42.72 31.53,42.72 v30.64,41.83 | v30.64,41.83 30.9,42.09 | v31.79,39.29 30.64,40.43 v30.64,41.83
+3V3  (via drill 0.35)
  Top 0.152: C27.2 13.83,39.91 U$1.1 U$1.64 | 14.51,27.11 15.71,27.11 16.75,28.15 U$1.19 16.88,30.17 16.88,30.84 17.04,31 17.72,31 18.26,31.54 18.58,31.54 19.47,32.43 19.47,33.19 18.96,33.7 18.96,34.46 19.21,34.72 19.95,34.72 23.25,31.42 U$1.32 23.25,26.87 24.44,25.68 R9.2 | 14.51,27.11 C26.2 | U3.1 6.13,18.66 C24.1 8,22.65 9.69,22.65 12.23,20.11 12.23,16.3 11.89,15.96 U3.19 | 45.06,43.46 48.06,43.46 48.55,42.97 48.55,38.96 U1.15 47.02,37.73 46.52,37.23 46.52,36.39 45.5,35.37 45.17,35.37 44.9,35.11 U1.7 | 45.06,43.46 44.3,43.46 43.29,44.47 43.29,45.28 43.06,45.51 42.58,45.51 41.37,46.72 40.68,47.42 v40.68,48.81 | U1.18 45.41,39.2 45.88,39.67 45.88,42.64 45.06,43.46 | v3.34,30.27 3,30.27 1.73,31.54 | v6.77,30.27 8.93,28.11 13.51,28.11 14.51,27.11 | U2.8 24.01,57.3
  Top 0.2: U3.1 4.65,18.46 1.73,21.38 | U$1.48 27.67,39.45 28.06,39.84 C28.2 | U4.4 39.53,44.12 C22.1 41.57,43.36 42.2,43.99 42.2,45.89 41.37,46.72 40.8,47.29 39.41,47.29 38.9,46.78 38.9,45.81 U4.6 | U7.P$4 28.35,46.91 C13.1 | 47.79,1.73 47.79,4.06 3V3.TP 49.87,6.14 49.89,6.14 P1.1
  Top 0.254: v7.88,45.78 11.42,49.32 18.58,49.32 | 21.12,49.32 22.55,47.89 R4.2 | 18.58,49.32 21.12,49.32 | 18.58,49.32 18.96,48.94 v18.96,48.18 | R3.2 25.22,46.91 v26.58,46.91 27.74,46.91 C13.1 | v26.2,41.7 28.06,39.84 | 21.12,49.32 22.36,49.32 | 22.37,49.34 22.36,49.32 | 27.47,54.4 25.97,52.9 25.97,52.86 22.43,49.32 22.36,49.32 | 24.01,57.3 24.28,57.58 26.83,57.58 27.47,56.94 27.47,54.4 | 27.47,54.4 28.23,54.4 v29.37,55.54 | v29.12,53.13 29.12,52.43 U7.P$1
  Top 0.508: v7.88,45.78 7.96,45.78 C27.2 | U$4.@2 23.66,8 23.66,11.08 U5.5
  Top 1.27: 19.69,3.44 18.44,4.69 16.58,4.69 14.22,2.33 8.91,2.33 6.35,4.89 3.05,4.89 1.73,6.22 1.73,21.38 1.73,31.54 1.73,47.05 | 19.69,3.44 21.4,1.73 22.39,1.73 | 1.73,47.05 1.73,52.1 D1.4 D1.5 D1.6 | 22.39,1.73 47.79,1.73 51.6,1.73 | 51.6,1.73 52.87,1.73 | 52.87,1.73 55,1.73 55.29,1.75 58.25,4.71 58.27,5 58.27,39.6 v57.95,39.92 | 1.73,47.05 4.07,49.4 v4.07,49.59 | 19.69,3.44 21.12,4.87 | 21.12,4.87 21.78,5.53 | 21.78,5.53 U$4.@2 | 21.78,2.33 21.12,3 21.12,4.87 | 22.39,1.73 21.78,2.33 | 21.78,2.33 21.78,5.53 | C21.1 52.75,2.88 51.6,1.73 | C20.1 55.12,3.98 52.87,1.73
  Bottom 0.152: v3.34,30.27 v6.77,30.27
  Bottom 0.254: v18.96,48.18 20.23,46.91 v26.58,46.91 26.2,46.53 v26.2,41.7 | v29.37,55.54 29.37,53.38 v29.12,53.13
  Bottom 0.508: v57.95,39.92 57.95,37.89 51.6,31.54 47.79,31.54 42.71,36.62 42.71,46.78 v40.68,48.81
  Bottom 1.27: v4.07,49.59 v7.88,45.78
+5V
  Top 0.152: D3.@2 16.83,11.52 R7.1 18.11,13.16 18.6,13.65 U5.3 U5.2 19.85,14.92 19.67,14.92 | C18.1 20.29,21.51 27.59,21.51 28.89,20.21 5V.TP
  Top 0.254: 19.85,14.92 18.69,14.92 18.45,15.16 18.45,16.22 16.97,17.7 Q2.P2 18.48,20.23 C18.1
ANT
  Top 0.152: C7.2 53,41.27 C6.2 51.47,44.56 51.47,51.86 49.69,53.64 49.69,57.77 J$1.SIG
B_VBUS  (via drill 0.35)
  Top 0.152: 10.01,6.87 J1.B9 10.01,5.56 v10.32,5.25 | J1.B4 12.65,6.38 12.65,6.02 13.37,5.3 v13.37,5.25
  Bottom 0.152: v10.32,5.25 v13.37,5.25
CAP
  Top 0.2: C12.1 26.89,50.8 29.5,50.8 U7.P$2
GND  (via drill 0.35)
  Top 0.152: v18.58,50.59 18.58,52.07 U2.4 | v24.8,54.91 24.4,55.31 U2.7 | U3.20 11.19,16.43 9.06,16.43 U3.33 8.67,16.71 8.42,16.96 U3.4 | 9.69,16.3 10.59,15.39 10.59,15.25 10.88,14.96 U3.17 | J1.B12 8.44,6.51 J1.SH3 | J1.SH2 17.29,2.16 J1.SH8 | 45.25,37.89 45.07,38.07 44.67,38.07 44.53,38.2 44.53,38.5 U1.20 | U1.8 45.42,34.4 45.1,34.08 43.98,34.08 43.27,33.37 42.71,33.37 | 8.42,30.14 10.07,28.49 15.53,28.49 16.25,29.21 U$1.18 16.25,30.82 v15.4,31.67
  other vias: 40.42,45.89 4.61,10.2 24.17,18.21 28.74,17.06 25.82,10.33 10.2,20.75 12.1,14.14 8.42,17.57 27.34,52.37 30.64,30.02 47.66,39.29 48.42,37.76 40.17,30.27 24.8,49.57 20.48,48.43 27.34,38.4 20.99,24.94 28.36,43.61 25.56,28.37 8.16,31.03 13.37,25.7 32.85,15.64 42.5,11.78 43.72,24.68 49.51,27.63 51.85,22.65 56.53,8.32 5.52,43.68 7.05,42.67 8.87,49.47 10.6,46.22 14.67,50.49 14.56,54.04 21.73,43.17 43.98,58.21 45.25,56.94 43.98,55.67 42.71,56.94 45.25,54.4 43.98,53.13 42.71,54.4 41.44,55.67 46.52,53.13 47.79,54.4 49.06,53.13 51.6,53.13 50.33,54.4 52.87,54.4 52.87,51.86 54.14,53.13 54.14,55.67 55.41,54.4 55.41,56.94 54.14,58.21 56.68,55.67 57.95,54.4 56.68,53.13 55.41,51.86 45.25,51.86 47.79,51.86 42.71,51.86 41.44,53.13 41.44,58.21 50.33,51.86
  pour Top: 57.49,62.29 arc-90 62.49,57.29 62.49,2.52 arc-90 57.49,-2.48 1.45,-2.48 arc-90 -3.55,2.52 -3.55,59.75 arc-90 -1.01,62.29
  pour Bottom: -4.82,59.75 -4.82,3.4 arc45 -3.35,-0.13 4.07,-7.56 48.68,-7.56 arc45 61.42,-2.28 63.76,0.06 63.76,57.68 arc45 62.3,61.22 59.95,63.56 1.06,63.56 arc45 -2.47,62.1
LED_SDO  (via drill 0.35)
  Top 0.152: TP9.TP 25.54,54.76 24.82,54.04 U2.6 23.81,53.51 24.93,53.51 v25.31,53.13 | U$1.21 17.75,28.05 v15.02,25.32
  Bottom 0.152: v15.02,25.32 12.23,28.11 12.23,46.56 14.98,49.32 22.39,49.32 25.31,52.24 v25.31,53.13
MOTOR1
  Top 0.152: ESC1.1 30.61,58.48 10.42,58.48 9.15,57.21 9.15,52.13 3.82,46.8 3.82,31.18 7.26,27.73 9.94,27.73 13.75,23.92 17.94,23.92 18.25,24.23 U$1.22
MOTOR2
  Top 0.152: ESC2.1 5.14,27.27 9.69,27.27 13.42,23.54 18.2,23.54 18.75,24.09 U$1.23
MOTOR3  (via drill 0.35)
  Top 0.152: v29.63,8.05 30.61,7.06 ESC3.1 | U$1.26 20.25,28.14 v19.85,27.73
  Bottom 0.152: v19.85,27.73 21.12,26.46 22.64,24.94 22.64,17.32 29.63,10.33 v29.63,8.05
MOTOR4  (via drill 0.35)
  Top 0.152: U$1.27 20.76,26.99 19.97,26.21 19.97,23.92 20.58,23.31 28.7,23.31 30.04,21.97 31.58,21.97 34.71,18.84 52.61,18.84 v52.74,18.71 | v52.99,28.11 55.28,30.39 ESC4.1
  Bottom 0.152: v52.74,18.71 52.99,18.97 v52.99,28.11
N$1
  Top 0.152: R1.1 48.31,30.11 46.86,28.66 | 46.86,28.66 Q1.1 | U1.9 45.92,34.27 45.15,33.5 43.84,33.5 43.12,32.79 C1.1 43.47,31.94 43.47,30.91 43.98,30.4 45.25,30.4 46.86,28.79 46.86,28.66
N$2
  Top 0.152: Q1.3 46.41,34.22 U1.10 47.11,34.12 R1.2 50.36,36.17 C2.1
N$3
  Top 0.152: U1.12 48.52,36.22 49.76,37.46 L3.1 50.93,39.27 L2.2
N$4
  Top 0.152: R2.1 46.68,38.89 U1.16
N$5
  Top 0.152: C3.1 44.91,40.78 U1.19
N$6
  Top 0.152: U1.13 48.4,36.72 49.08,37.41 49.08,38.54 49.76,39.22 L3.2 49.84,39.47 L1.1
N$7
  Top 0.152: U1.11 48.92,35.72 51.17,37.97 L2.1 51.56,37.95 C5.1 53.31,37.93 C4.1
N$8
  Top 0.152: X1.1 10.17,35.35 | 10.17,35.35 10.17,35.71 11.92,37.46 U$1.5 | C8.2 7.33,35.35 10.17,35.35
N$9
  Top 0.152: C7.1 53.59,40.43 51.97,40.43 L1.2
N$10
  Top 0.152: U$1.6 13.02,36.95 12.26,36.18 12.26,34.74 10.94,33.43 X1.2 7.95,33.43 C9.2
N$11
  Top 0.152: D1.1 15.02,52.67 | 17.69,51.23 BLTP.TP 16.36,52.18 15.52,52.18 15.02,52.67 | 15.02,52.67 15.25,52.67 16.61,54.04 U2.3
N$12
  Top 0.152: D1.3 12.1,56.58 U2.1 20.21,56.58 21.12,55.67 21.12,51.99 RLTP.TP
N$13
  Top 0.152: C10.2 9.85,40.66 X2.1 12.06,38.45 U$1.3
N$14
  Top 0.152: C11.2 7.06,38 X2.2 10.06,37.95 U$1.4
N$15
  Top 0.2: R8.2 17.59,5.58 16.21,5.58 14.99,4.36 12.88,4.36 12.01,5.23 J1.B5
N$16
  Top 0.152: U$1.60 17.75,42.45 18.3,43 19.36,43 20.31,43.95 R5.2
N$17
  Top 0.2: U$1.30 22.25,27.43 C14.2
N$20
  Top 0.152: U5.1 20.01,17.08 C19.1
N$21
  Top 0.152: J1.A6 11.26,9.63 11.6,9.96 11.6,12.72 11.04,13.27 10.01,13.27 9.53,13.75 U3.14
N$22
  Top 0.152: J1.A7 11.74,8.14 11.74,9.51 12.01,9.77 12.01,12.86 11.24,13.63 10.32,13.63 10.02,13.92 U3.15
N$23
  Top 0.152: R7.2 19.81,12.18 U5.4
N$24
  Top 0.152: 28.12,11.87 D2.1 | C19.2 26.32,18.95 26.47,18.95 26.96,18.46 26.96,15.79
  Top 0.2: D2.1 28.74,11.25 | U$4.@1 25.88,7.95 28.12,10.19 28.12,11.87 28.12,14.63 26.96,15.79 26.56,16.19 U5.8
N$25
  Top 0.406: 5V_BAT.1 35.31,4.95 30.39,9.88 30.39,16.68 31.28,17.57 31.28,20.11 29.19,22.2 17.67,22.2 Q2.P3
N$26
  Top 0.2: R11.2 7.74,10.24 8.13,9.85 9.61,9.85 10.78,8.69 10.78,8.13 J1.A5
N$27
  Top 0.152: D1.2 12.11,54.78 | 12.11,54.78 12.64,55.31 | GLTP.TP 19.97,54.53 19.24,55.26 19.19,55.31 U2.2 13.9,55.31 13.37,54.78 12.11,54.78
NRST
  Top 0.152: P1.10 54.97,19.65 U$2.2 U$2.1 48.46,20.21 C17.2 46.4,22.27 30.17,22.27 25.07,27.38 R9.1 24.73,30.36 18.64,36.45 U$1.7
PC1  (via drill 0.35)
  Top 0.152: U$1.9 15.93,35.45 17.69,33.7 v17.69,32.05
  Bottom 0.152: v17.69,32.05 18.61,32.05 19.62,33.06 21.07,33.06 23.04,31.09 36.17,31.09 P4.1
PC2  (via drill 0.35)
  Top 0.152: U$1.10 14.78,34.95 v16.67,33.06
  Bottom 0.152: v16.67,33.06 16.67,31.79 17.18,31.29 18.83,31.29 19.95,32.4 21.15,32.4 22.77,30.78 32.67,30.78 34.83,28.62 39.12,28.62 P4.2
PC3  (via drill 0.35)
  Top 0.152: U$1.11 14.51,34.45 15.66,33.31 v15.66,32.94
  Bottom 0.152: P4.3 36.85,26.41 41.1,26.41 41.56,25.95 41.56,23.92 41.06,23.41 34.5,23.41 28.46,29.46 18.5,29.46 16.1,31.86 16.1,32.49 v15.66,32.94
PC4  (via drill 0.35)
  Top 0.152: U$1.24 19.25,30.82 20.23,31.79 v20.61,31.79
  Bottom 0.152: P4.4 34.06,24.54 28.71,29.89 21.5,29.89 21.12,30.27 21.12,31.29 v20.61,31.79
PC5  (via drill 0.35)
  Top 0.152: U$1.25 19.75,30.71 20.15,31.11 20.94,31.11 21.24,31.41 21.24,32.18 19.72,33.7 v19.72,34.08
  Bottom 0.152: v19.72,34.08 19.85,34.21 19.85,34.84 19.34,35.35 16.04,35.35 14.77,34.08 14.77,30.27 16.04,29 28.36,29 34.82,22.54 P5.1
PC6  (via drill 0.35)
  Top 0.152: U$1.37 26.2,33.95 26.63,33.52 26.63,28.11 27.88,26.87 27.88,26.61 v27.47,26.21
  Bottom 0.152: v27.47,26.21 27.72,26.46 28.99,26.46 33.87,21.58 38.15,21.58 P5.2
PC7  (via drill 0.35)
  Top 0.152: U$1.38 26.33,34.45 26.93,33.85 26.93,28.24 28.73,26.45 28.73,25.43 v28.48,25.19
  Bottom 0.152: v28.48,25.19 29.83,25.19 33.74,21.28 34.56,21.28 36.72,19.11 P5.3
PC8  (via drill 0.35)
  Top 0.152: U$1.39 26.42,34.95 27.24,34.13 27.24,28.37 29.09,26.52 29.09,24.58 v29.5,24.17
  Bottom 0.152: v29.5,24.17 30.42,24.17 34.2,20.39 34.2,18.21 36.1,16.3 40.17,16.3 39.93,16.54 P5.4
PC9  (via drill 0.35)
  Top 0.152: U$1.40 26.47,35.45 27.54,34.39 27.54,28.49 30.34,25.7 v30.77,25.7
  Bottom 0.152: v30.77,25.7 34.58,21.89 37.99,21.89 38.75,22.65 40.55,22.65 41.69,21.51 41.69,15.67 40.42,14.4 36.86,14.4 P6.1
PC10  (via drill 0.35)
  Top 0.152: U$1.51 22.25,40.18 21.35,39.29 19.47,39.29 v19.34,39.16
  Bottom 0.152: v19.34,39.16 19.85,38.65 19.85,38.27 18.58,37 16.8,37 14.01,34.21 14.01,29.51 19.59,23.92 19.59,19.83 27.24,12.18 27.24,8.4 33.31,2.33 49.06,2.33 50.71,3.98 50.71,11.09 50.2,11.6 47.41,11.6 42.71,6.9 36.87,6.9 35.09,8.68 35.09,11.22 36.41,12.54 P6.2
PC11  (via drill 0.35)
  Top 0.152: v18.32,38.14 18.45,38.27 18.45,39.41 18.91,39.87 21.31,39.87 21.75,40.31 U$1.52
  Bottom 0.152: v18.32,38.14 15.91,38.14 13.5,35.73 13.5,29.25 16.16,26.59 16.67,26.08 18.58,24.17 18.58,14.57 31.28,1.87 49.87,1.87 51.6,3.6 51.6,11.35 50.45,12.49 47.41,12.49 42.71,7.79 37.25,7.79 36.36,8.68 36.36,10.18 P6.3 36.72,10.86
PC12  (via drill 0.35)
  Top 0.152: v17.31,39.16 18.45,40.3 21.11,40.3 21.25,40.44 U$1.53
  Bottom 0.152: v17.31,39.16 16.04,39.16 12.86,35.99 12.86,29.13 18.27,23.72 18.27,14.45 31.4,1.32 31.4,1.31 50.71,1.31 52.49,3.09 52.49,11.47 50.58,13.38 47.41,13.38 42.57,8.54 P6.4
REGOUT
  Top 0.152: C15.1 32.9,27.5 30.66,27.5 30.28,27.88 U6.10
RF_CE  (via drill 0.35)
  Top 0.152: v18.7,33.06 18.7,33.11 15.87,35.95 U$1.8 | v39.41,33.57 39.91,34.08 42.83,34.08 44.06,35.31 44.06,37.61 43.95,37.72 U1.1 43.64,37.72
  Bottom 0.152: v18.7,33.06 19.09,33.45 21.5,33.45 23.42,31.52 38.18,31.52 P3.4 39.41,32.75 v39.41,33.57
RF_IRQ  (via drill 0.35)
  Top 0.152: U$1.29 21.75,29 21.12,28.37 21.12,26.79 20.28,25.95 20.28,24.38 20.86,23.79 23.53,23.79 v23.66,23.92 | v38.77,42.34 39.6,42.34 39.7,42.44 41.33,42.44 43.65,40.12 43.65,38.58 44.41,37.82 U1.6
  Bottom 0.152: v23.66,23.92 23.66,27.73 22.69,28.7 15.91,28.7 14.46,30.14 14.46,34.21 15.91,35.66 17.66,35.66 19.87,37.87 21.14,37.87 22.39,36.62 27.21,36.62 28.61,38.02 32.2,38.02 P2.3 38.57,42.54 v38.77,42.34
RF_MISO  (via drill 0.35)
  Top 0.152: U$1.35 24.49,32.95 23.9,33.54 23.9,34.18 22.23,35.86 v20.99,35.86 | v39.79,37.64 38.77,36.62 37.28,36.62 36.18,35.53 36.18,34.89 36.99,34.08 39.06,34.08 40.27,35.3 43.09,35.3 U1.5
  Bottom 0.152: v20.99,35.86 26.96,35.86 28.69,37.59 32.42,37.59 36.41,41.57 40.42,41.57 41.06,40.94 41.06,37.51 40.09,36.54 P3.2 39.79,37.13 v39.79,37.64
RF_MOSI  (via drill 0.35)
  Top 0.152: U$1.36 24.49,33.46 24.21,33.74 24.21,35.31 22.64,36.87 22.64,37.64 v23.02,38.02 | v37.12,35.6 41.69,35.6 42.28,36.19 43.48,36.19 U1.4
  Bottom 0.152: v23.02,38.02 23.66,37.38 27.47,37.38 28.48,38.4 31.79,38.4 33.82,40.43 33.82,41.7 35.47,43.35 40.29,43.35 41.44,42.21 41.44,35.35 40.63,34.54 P3.3 37.12,34.94 v37.12,35.6
RF_SCK  (via drill 0.35)
  Top 0.152: U$1.34 24.36,32.46 23.32,33.5 23.32,33.91 v23.28,33.95 | v38.9,39.29 40.04,39.29 42.58,36.75 43.48,36.75 U1.3
  Bottom 0.152: v23.28,33.95 23.96,33.27 32.85,33.27 36.72,37.14 P3.1 37.24,39.06 37.47,39.29 v38.9,39.29
RF_SS  (via drill 0.35)
  Top 0.152: U$1.33 24.05,31.96 22.67,33.34 22.67,34.18 v22.01,34.84 | v36.99,39.67 37.75,40.43 41.44,40.43 42.71,39.16 42.71,37.72 43.21,37.22 U1.2
  Bottom 0.152: v22.01,34.84 22.72,35.55 30.82,35.55 35.81,40.54 37.86,40.54 | v36.99,39.67 37.86,40.54 | 37.86,40.54 P2.4
SENSOR_SCL  (via drill 0.35)
  Top 0.152: R3.1 23.91,46.52 23.91,47.8 24.39,48.27 27.72,48.27 27.98,48.53 | U$1.61 17.25,42.79 v18.58,44.11 | U7.P$8 32.04,52.51 v32.04,52.88 | v24.93,43.99 24.93,45.47 R3.1
  Top 0.2: R3.1 26.2,44.24 32.1,44.24 35.17,41.17 35.17,40.91 Q6.3 | U7.P$8 32.24,51.93 31.04,50.73 31.04,50.22 30.9,50.08 28.67,50.08 27.98,49.39 27.98,48.53
  Bottom 0.152: v24.93,43.99 18.7,43.99 v18.58,44.11 | P2.1 38.39,48.21 38.39,51.1 36.36,53.13 32.29,53.13 v32.04,52.88
SENSOR_SCL_LV
  Top 0.152: R14.1 32.44,32.81 30.01,32.81 29.48,32.28 U6.23
  Top 0.2: Q6.2 33.28,39.54 R14.1
SENSOR_SDA  (via drill 0.35)
  Top 0.152: U$1.62 16.76,43.56 19.36,46.17 21.87,46.17 R4.1 | v36.36,54.4 35.98,54.02 32.55,54.02
  Top 0.2: Q3.3 32.8,40.91 32.8,41.17 31.01,42.97 24.43,42.97 22.55,44.86 R4.1 23.4,46.34 23.4,49.58 27.85,54.02 32.55,54.02 33.31,54.02 34.58,52.75 34.58,51.35 33.9,50.68 U7.P$7
  Bottom 0.152: P2.2 39.2,51.56 v36.36,54.4
SENSOR_SDA_LV
  Top 0.2: U6.24 29.08,33.54 R12.1 29.19,34.98 29.8,35.59 29.8,38.96 31.19,40.35 Q3.2
SWCLK  (via drill 0.35)
  Top 0.152: 51.16,13.74 P1.4 51.16,13.83 50.07,12.74 48.04,12.74 47.66,12.36 v47.66,7.41 | v26.45,27.22 26.45,27.35 26.2,27.6 26.2,29.38 19.85,35.73 19.85,37.13 23.25,40.53 U$1.49
  Bottom 0.152: v47.66,7.41 44.87,7.41 43.16,5.71 36.28,5.71 25.82,16.17 25.82,24.43 26.45,25.06 v26.45,27.22
SWDIO  (via drill 0.35)
  Top 0.152: 49.89,13.74 P1.2 48.71,14.69 45.63,11.6 v45.63,8.68 | U$1.46 25.85,38.45 27.85,36.46 27.85,28.62 28.74,27.73 29.63,27.73 31.66,25.7 31.66,23.92 30.64,22.9 v30.52,22.9
  Bottom 0.152: v45.63,8.68 42.96,6.01 36.48,6.01 26.2,16.3 26.2,21.89 27.21,22.9 v30.52,22.9
USB_RX  (via drill 0.35)
  Top 0.2: v8.29,21.51 8.29,21.33 8.01,21.05 8.01,19.18 U3.30 | v11.08,29.76 15.53,29.76 15.75,29.99 U$1.17
  Bottom 0.2: v8.29,21.51 8.29,23.79 9.69,25.19 9.69,29 10.45,29.76 v11.08,29.76
USB_TX  (via drill 0.35)
  Top 0.2: U3.2 6.31,17.98 5.46,17.98 4.61,17.13 v4.61,16.94 | v10.07,30.78 11.24,31.95 U$1.16
  Bottom 0.2: v4.61,16.94 3.85,17.7 3.85,24.56 v10.07,30.78
USB_VCC
  Top 0.152: JP1.2 2.98,12.21 2.98,8.44 USB_VCC.TP | D3.@1 8.04,13.24 5.04,13.24 JP1.1 JP1.2 | JP1.2 3.37,10.12 4.21,9.27 9.6,9.27 10.26,8.61 J1.A4 10.26,7.61 10.46,7.41 12.48,7.41 12.76,7.69 J1.A9 12.76,16.6 14.94,18.78 15.01,18.78 Q2.P1
  Top 0.2: R10.2 15.07,18.78 Q2.P1

### Text on the board
bPlace: SENSOR_SCL | SENSOR_SDA | RF_IRQ | PC3 | RF_SS | RF_SCK | RF_MISO | RF_MOSI | RF_CE | PC1 | PC2 | Designed by Adam in California / (while Devin watched) | PC4 | PC5 | PC6 | PC7 | PC8 | PC9 | PC10 | PC11 | PC12